# EAGLE design Wobbler_Rev1 (EAGLE 7.7.0)

## Sheet 1 of 5: MCU & Eeprom
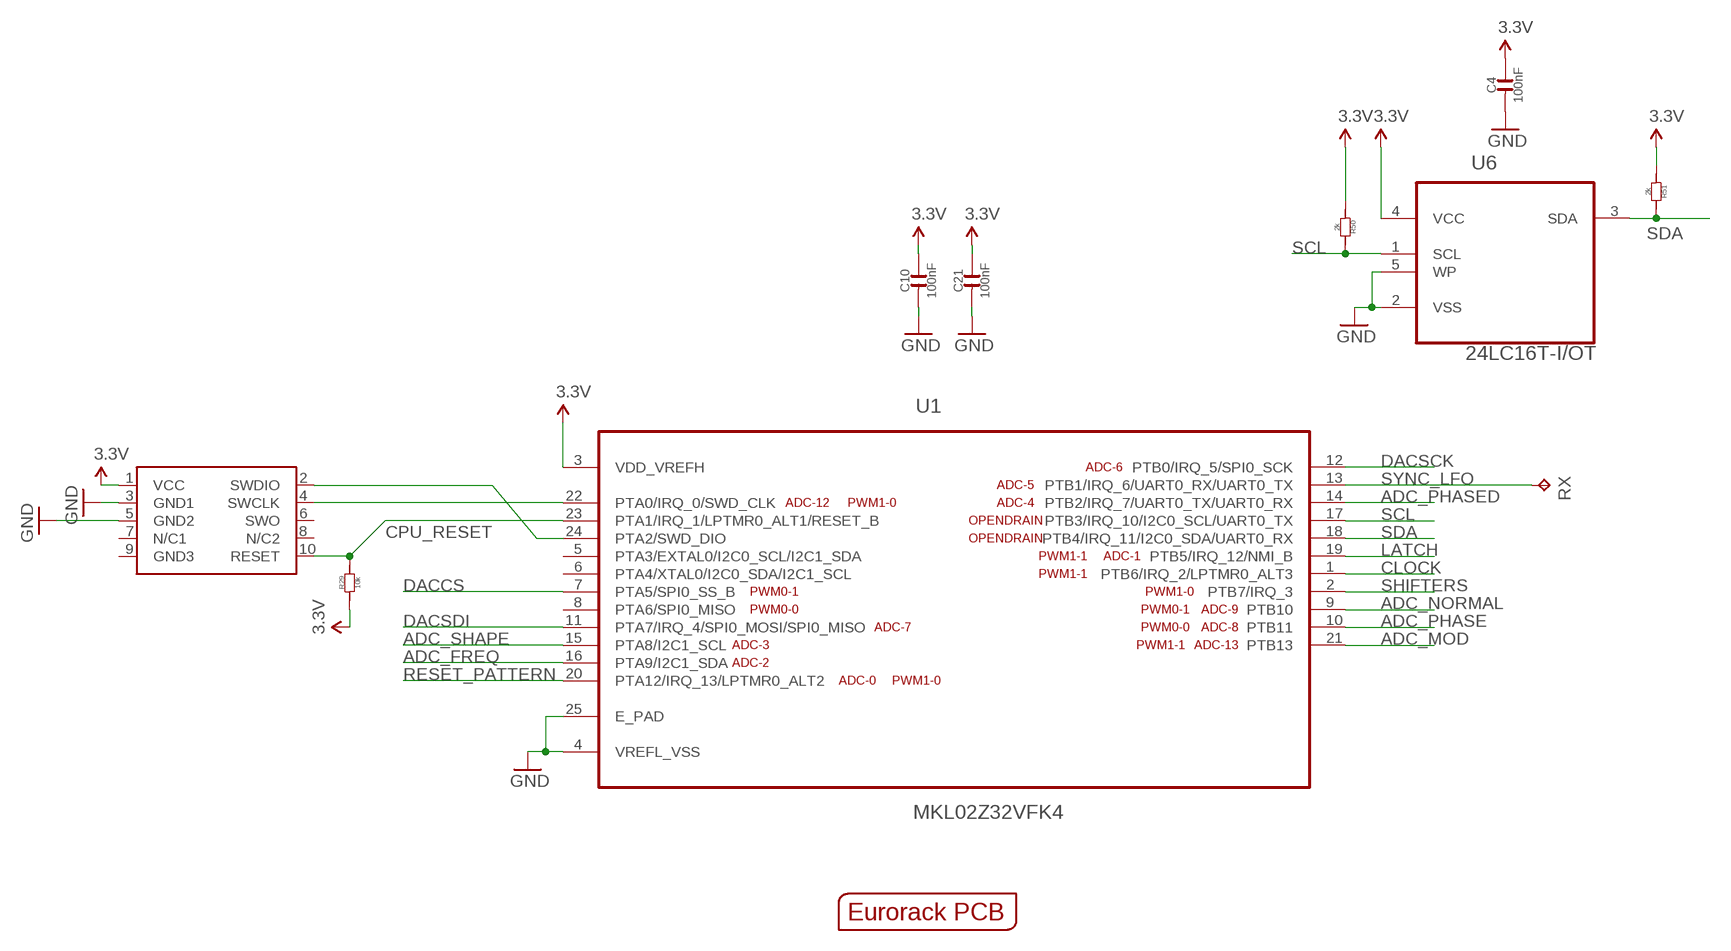
[diagram p0: schematic, sheet 1]

### Parts
C4  100nF  C-0603  [C0603]
C10  100nF  C-0603  [C0603]
C21  100nF  C-0603  [C0603]
OUTLINE  EURORACK_PCB12HP  [EURORACK12HPPCB]
R29  10k  R-0603  [R0603]
R50  2k  R-0603  [R0603]
R51  2k  R-0603  [R0603]
RX  TPB1,27  [B1,27]
SWD1  CORTEX_SWD  [M50-3600542]
U1  MKL02Z32VFK4  [QFN50P400X400X100-25N]
U6  24LC16T-I/OT  24LC00T-I/OT  [SOT95P290X145-5N]

### Nets
3.3V [mediumpower]: C4.2 C10.2 C21.2 R29.1 R50.1 R51.1 SWD1.1(VCC) U1.3(VDD_VREFH) U6.4(VCC) ; also sheet 2,3,4,5
ADC_FREQ: U1.16(PTA9/I2C1_SDA) ; also sheet 5
ADC_MOD: U1.21(PTB13) ; also sheet 5
ADC_NORMAL: U1.9(PTB10) ; also sheet 5
ADC_PHASE: U1.10(PTB11) ; also sheet 5
ADC_PHASED: U1.14(PTB2/IRQ_7/UART0_TX/UART0_RX) ; also sheet 5
ADC_SHAPE: U1.15(PTA8/I2C1_SCL) ; also sheet 5
CLOCK: U1.1(PTB6/IRQ_2/LPTMR0_ALT3) ; also sheet 2
CPU_RESET: R29.2 SWD1.10(RESET) U1.23(PTA1/IRQ_1/LPTMR0_ALT1/RESET_B)
DACCS: U1.7(PTA5/SPI0_SS_B) ; also sheet 3
DACSCK: U1.12(PTB0/IRQ_5/SPI0_SCK) ; also sheet 3
DACSDI: U1.11(PTA7/IRQ_4/SPI0_MOSI/SPI0_MISO) ; also sheet 3
GND [groundplane]: C4.1 C10.1 C21.1 SWD1.3(GND1) SWD1.5(GND2) U1.4(VREFL_VSS) U1.25(E_PAD) U6.2(VSS) U6.5(WP) ; also sheet 2,3,4,5
LATCH: U1.19(PTB5/IRQ_12/NMI_B) ; also sheet 2
RESET_PATTERN: U1.20(PTA12/IRQ_13/LPTMR0_ALT2) ; also sheet 2,5
SCL: R50.2 U1.17(PTB3/IRQ_10/I2C0_SCL/UART0_TX) U6.1(SCL)
SDA: R51.2 U1.18(PTB4/IRQ_11/I2C0_SDA/UART0_RX) U6.3(SDA)
SHIFTERS: U1.2(PTB7/IRQ_3) ; also sheet 2
SWD_CLK: SWD1.4(SWCLK) U1.22(PTA0/IRQ_0/SWD_CLK)
SWD_DIO: SWD1.2(SWDIO) U1.24(PTA2/SWD_DIO)
SYNC_LFO: RX.TP U1.13(PTB1/IRQ_6/UART0_RX/UART0_TX) ; also sheet 5
Unconnected: SWD1.6(SWO) SWD1.7(N/C1) SWD1.8(N/C2) SWD1.9(GND3) U1.5(PTA3/EXTAL0/I2C0_SCL/I2C1_SDA) U1.6(PTA4/XTAL0/I2C0_SDA/I2C1_SCL) U1.8(PTA6/SPI0_MISO)

## Sheet 2 of 5: LEDs & button
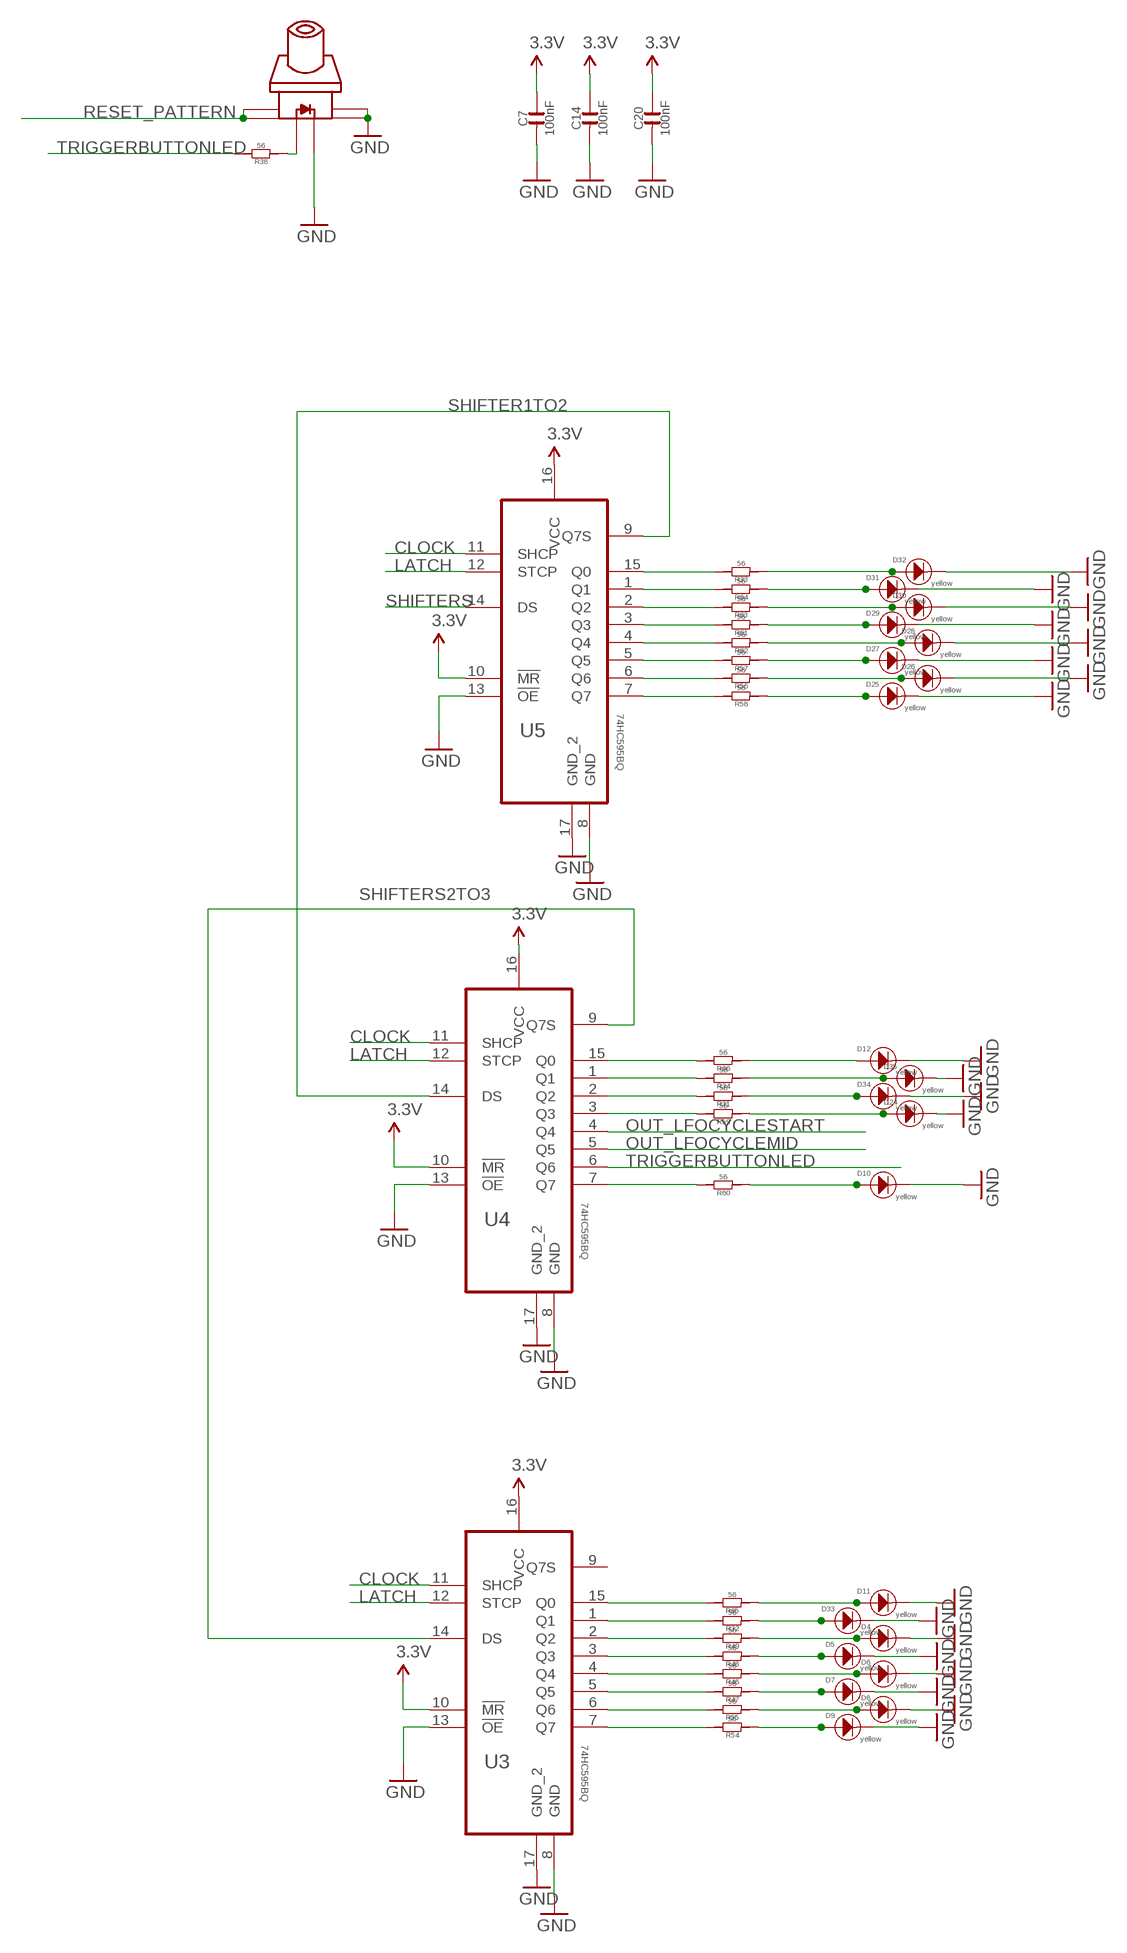
[diagram p1: schematic, sheet 2]

### Parts
C7  100nF  C-0603  [C0603]
C14  100nF  C-0603  [C0603]
C20  100nF  C-0603  [C0603]
D4  yellow  LED3MM  [3MMLED]
D5  yellow  LED3MM  [3MMLED]
D6  yellow  LED3MM  [3MMLED]
D7  yellow  LED3MM  [3MMLED]
D8  yellow  LED3MM  [3MMLED]
D9  yellow  LED3MM  [3MMLED]
D10  yellow  LED3MM  [3MMLED]
D11  yellow  LED3MM  [3MMLED]
D12  yellow  LED3MM  [3MMLED]
D24  yellow  LED3MM  [3MMLED]
D25  yellow  LED3MM  [3MMLED]
D26  yellow  LED3MM  [3MMLED]
D27  yellow  LED3MM  [3MMLED]
D28  yellow  LED3MM  [3MMLED]
D29  yellow  LED3MM  [3MMLED]
D30  yellow  LED3MM  [3MMLED]
D31  yellow  LED3MM  [3MMLED]
D32  yellow  LED3MM  [3MMLED]
D33  yellow  LED3MM  [3MMLED]
D34  yellow  LED3MM  [3MMLED]
D35  yellow  LED3MM  [3MMLED]
R31  56  R-0603  [R0603]
R32  56  R-0603  [R0603]
R33  56  R-0603  [R0603]
R34  56  R-0603  [R0603]
R38  56  R-0603  [R0603]
R46  56  R-0603  [R0603]
R47  56  R-0603  [R0603]
R48  56  R-0603  [R0603]
R49  56  R-0603  [R0603]
R54  56  R-0603  [R0603]
R55  56  R-0603  [R0603]
R56  56  R-0603  [R0603]
R57  56  R-0603  [R0603]
R58  56  R-0603  [R0603]
R59  56  R-0603  [R0603]
R60  56  R-0603  [R0603]
R61  56  R-0603  [R0603]
R62  56  R-0603  [R0603]
R63  56  R-0603  [R0603]
R64  56  R-0603  [R0603]
R65  56  R-0603  [R0603]
R66  56  R-0603  [R0603]
U3  74HC595BQ  [QFN50P250X350X100-17N]
U4  74HC595BQ  [QFN50P250X350X100-17N]
U5  74HC595BQ  [QFN50P250X350X100-17N]
U$1  SWITCH_W_LED_PB6149L-X-102YELLOW  [PB6149L]

### Nets
3.3V [mediumpower]: C7.2 C14.2 C20.2 U3.10(!MR) U3.16(VCC) U4.10(!MR) U4.16(VCC) U5.10(!MR) U5.16(VCC) ; also sheet 1,3,4,5
CLOCK: U3.11(SHCP) U4.11(SHCP) U5.11(SHCP) ; also sheet 1
GND [groundplane]: C7.1 C14.1 C20.1 D4.- D5.- D6.- D7.- D8.- D9.- D10.- D11.- D12.- D24.- D25.- D26.- D27.- D28.- D29.- D30.- D31.- D32.- D33.- D34.- D35.- U3.8(GND) U3.13(!OE) U3.17(GND_2) U4.8(GND) U4.13(!OE) U4.17(GND_2) U5.8(GND) U5.13(!OE) U5.17(GND_2) U$1.3 U$1.4 U$1.LEDNEG(NEG) ; also sheet 1,3,4,5
LATCH: U3.12(STCP) U4.12(STCP) U5.12(STCP) ; also sheet 1
N$1: R33.2 U5.15(Q0)
N$14: D7.+ R47.1
N$19: R64.2 U5.1(Q1)
N$22: R63.2 U5.2(Q2)
N$26: R61.2 U5.3(Q3)
N$28: D28.+ R62.1
N$30: R62.2 U5.4(Q4)
N$31: R57.2 U5.5(Q5)
N$32: D29.+ R61.1
N$35: R56.2 U5.6(Q6)
N$36: R58.2 U5.7(Q7)
N$37: R59.2 U4.3(Q3)
N$38: R54.2 U3.7(Q7)
N$39: R55.2 U3.6(Q6)
N$40: R47.2 U3.5(Q5)
N$41: R38.1 U$1.LEDPOS(POS)
N$43: R46.2 U3.4(Q4)
N$46: D6.+ R46.1
N$47: D5.+ R48.1
N$48: D4.+ R49.1
N$49: D8.+ R55.1
N$50: D9.+ R54.1
N$51: D10.+ R60.1
N$52: D11.+ R65.1
N$53: R48.2 U3.3(Q3)
N$54: R49.2 U3.2(Q2)
N$55: R32.2 U3.1(Q1)
N$56: R65.2 U3.15(Q0)
N$57: R60.2 U4.7(Q7)
N$58: R34.2 U4.1(Q1)
N$59: R31.2 U4.2(Q2)
N$62: R66.2 U4.15(Q0)
N$65: D12.+ R66.1
N$73: D27.+ R57.1
N$74: D26.+ R56.1
N$75: D25.+ R58.1
N$76: D24.+ R59.1
N$77: D30.+ R63.1
N$78: D31.+ R64.1
N$79: D32.+ R33.1
N$80: D33.+ R32.1
N$81: D34.+ R31.1
N$82: D35.+ R34.1
OUT_LFOCYCLEMID: U4.5(Q5) ; also sheet 3
OUT_LFOCYCLESTART: U4.4(Q4) ; also sheet 3
RESET_PATTERN: U$1.1 U$1.2 ; also sheet 1,5
SHIFTER1TO2: U4.14(DS) U5.9(Q7S)
SHIFTERS: U5.14(DS) ; also sheet 1
SHIFTERS2TO3: U3.14(DS) U4.9(Q7S)
TRIGGERBUTTONLED: R38.2 U4.6(Q6)
Unconnected: U3.9(Q7S)

## Sheet 3 of 5: DAC & Trigger outs
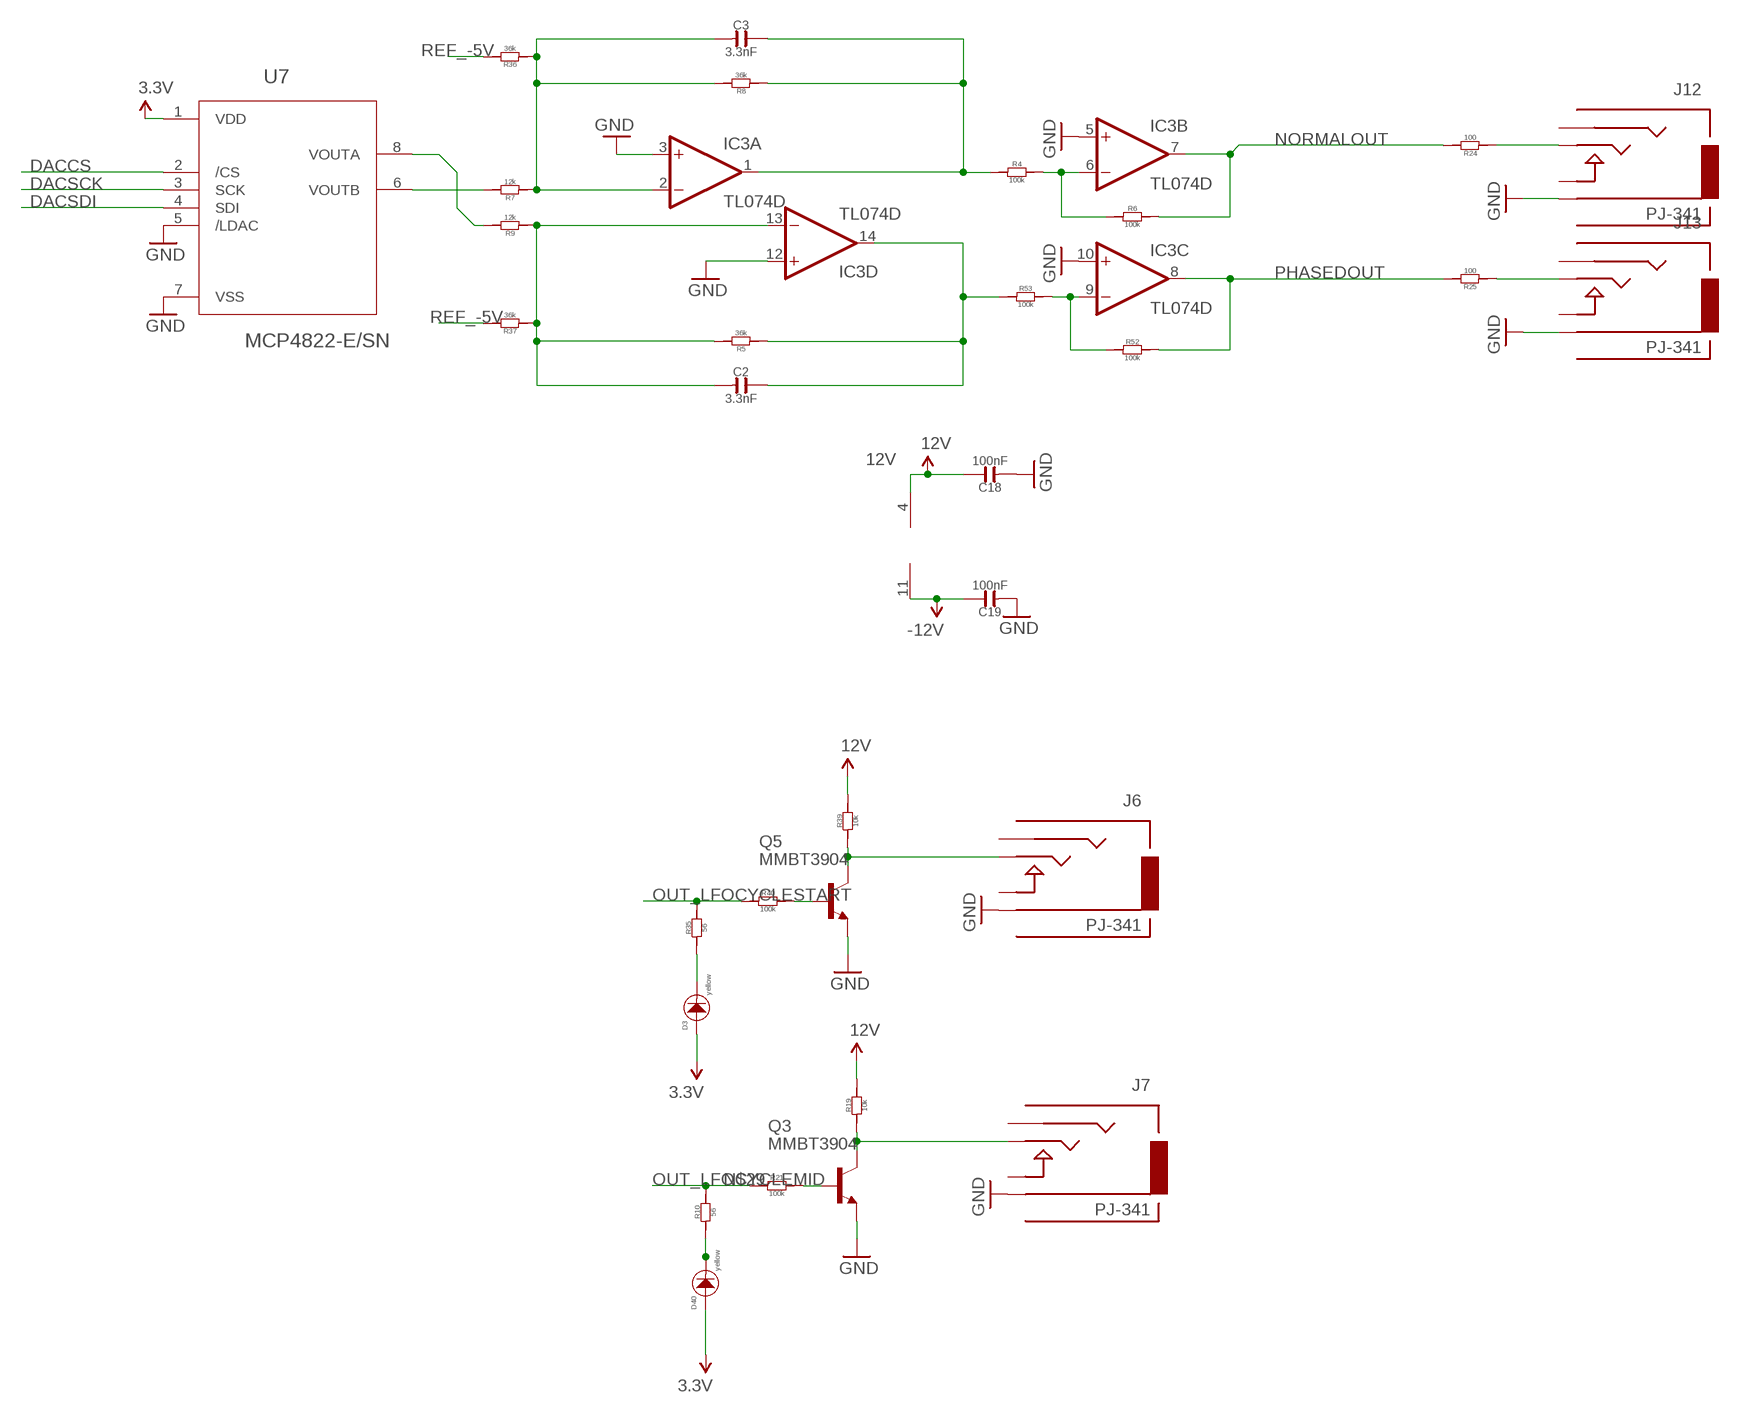
[diagram p2: schematic, sheet 3]

### Parts
C2  3.3nF  C-0603  [C0603]
C3  3.3nF  C-0603  [C0603]
C18  100nF  C-0603  [C0603]
C19  100nF  C-0603  [C0603]
D3  yellow  LED3MM  [3MMLED]
D40  yellow  LED3MM  [3MMLED]
IC3  TL074D  [SO14]
J6  PJ-341  AUDIO-JACKOUTPUT  [3.5MM-JACK-SWITCH-13MM-OUTPUT]
J7  PJ-341  AUDIO-JACKOUTPUT  [3.5MM-JACK-SWITCH-13MM-OUTPUT]
J12  PJ-341  AUDIO-JACKOUTPUT  [3.5MM-JACK-SWITCH-13MM-OUTPUT]
J13  PJ-341  AUDIO-JACKOUTPUT  [3.5MM-JACK-SWITCH-13MM-OUTPUT]
Q3  MMBT3904  MMBT3904LT1-NPN-SOT23-BEC  [SOT23-BEC]
Q5  MMBT3904  MMBT3904LT1-NPN-SOT23-BEC  [SOT23-BEC]
R4  100k  R-0603  [R0603]
R5  36k  R-0603  [R0603]
R6  100k  R-0603  [R0603]
R7  12k  R-0603  [R0603]
R8  36k  R-0603  [R0603]
R9  12k  R-0603  [R0603]
R10  56  R-0603  [R0603]
R19  10k  R-0603  [R0603]
R21  100k  R-0603  [R0603]
R24  100  R-0603  [R0603]
R25  100  R-0603  [R0603]
R35  56  R-0603  [R0603]
R36  36k  R-0603  [R0603]
R37  36k  R-0603  [R0603]
R39  10k  R-0603  [R0603]
R40  100k  R-0603  [R0603]
R52  100k  R-0603  [R0603]
R53  100k  R-0603  [R0603]
U7  MCP4822-E/SN  [SOIC8-N_MC]

### Nets
3.3V [mediumpower]: D3.+ D40.+ U7.1(VDD) ; also sheet 1,2,4,5
12V [heavypower]: C18.2 IC3.4(P:V+) R19.2 R39.2 ; also sheet 4
-12V [heavypower]: C19.2 IC3.11(P:V-) ; also sheet 4
DACCS: U7.2(/CS) ; also sheet 1
DACSCK: U7.3(SCK) ; also sheet 1
DACSDI: U7.4(SDI) ; also sheet 1
GND [groundplane]: C18.1 C19.1 IC3.3(A:+IN) IC3.5(B:+IN) IC3.10(C:+IN) IC3.12(D:+IN) J6.RING@3(RING) J7.RING@3(RING) J12.RING@3(RING) J13.RING@3(RING) Q3.E Q5.E U7.5(/LDAC) U7.7(VSS) ; also sheet 1,2,4,5
N$2: IC3.6(B:-IN) R4.2 R6.1
N$5: R9.2 U7.8(VOUTA)
N$7: R7.2 U7.6(VOUTB)
N$9: C2.1 IC3.13(D:-IN) R5.2 R9.1 R37.1
N$10: C3.1 IC3.2(A:-IN) R7.1 R8.2 R36.1
N$17: IC3.9(C:-IN) R52.1 R53.2
N$18: C3.2 IC3.1(A:OUT) R4.1 R8.1
N$20: J13.TIP@3(TIP) R25.1
N$21: J12.TIP@3(TIP) R24.1
N$23: D40.- R10.1
N$24: C2.2 IC3.14(D:OUT) R5.1 R53.1
N$25: Q3.B R21.2
N$27: D3.- R35.1
N$29: J7.TIP@3(TIP) Q3.C R19.1
N$60: Q5.B R40.2
N$61: J6.TIP@3(TIP) Q5.C R39.1
NORMALOUT: IC3.7(B:OUT) R6.2 R24.2
OUT_LFOCYCLEMID: R10.2 R21.1 ; also sheet 2
OUT_LFOCYCLESTART: R35.2 R40.1 ; also sheet 2
PHASEDOUT: IC3.8(C:OUT) R25.2 R52.2
REF_-5V: R36.2 R37.2 ; also sheet 4,5
Unconnected: J6.SECOND@3(SECOND) J6.SWITCH@3(SWITCH) J7.SECOND@3(SECOND) J7.SWITCH@3(SWITCH) J12.SECOND@3(SECOND) J12.SWITCH@3(SWITCH) J13.SECOND@3(SECOND) J13.SWITCH@3(SWITCH)

## Sheet 4 of 5: Power
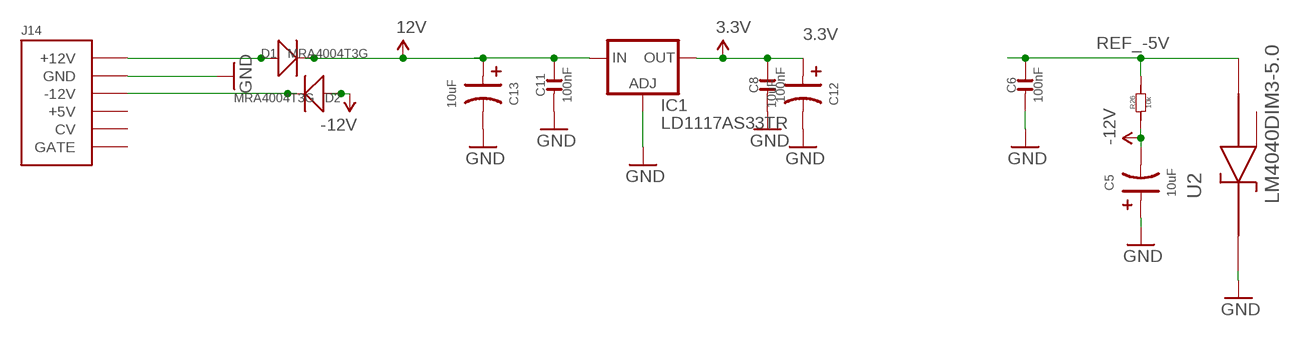
[diagram p3: schematic, sheet 4]

### Parts
C5  10uF  C-POLAR-A  [AVX-A]
C6  100nF  C-0603  [C0603]
C8  100nF  C-0603  [C0603]
C11  100nF  C-0603  [C0603]
C12  10uF  C-POLAR-A  [AVX-A]
C13  10uF  C-POLAR-A  [AVX-A]
D1  MRA4004T3G  D-SMA  [DO-214AC]
D2  MRA4004T3G  D-SMA  [DO-214AC]
IC1  LD1117AS33TR  [SOT223]
J14  POWERSMT  [2X08_SMT_HEADER]
R26  10k  R-0603  [R0603]
U2  LM4040DIM3-5.0  [SOT95P237X112-3N]

### Nets
3.3V [mediumpower]: C8.2 C12.+ IC1.2(OUT) IC1.4(OUT) ; also sheet 1,2,3,5
12V [heavypower]: C11.2 C13.+ D1.2(-) IC1.3(IN) ; also sheet 3
-12V [heavypower]: C5.- D2.1(+) R26.1 ; also sheet 3
GND [groundplane]: C5.+ C6.1 C8.1 C11.1 C12.- C13.- IC1.1(ADJ) J14.3(GND) J14.4(GND) J14.5(GND) J14.6(GND) J14.7(GND) J14.8(GND) U2.1(CATHODE) ; also sheet 1,2,3,5
N$13 [heavypower]: D1.1(+) J14.9(+12V) J14.10(+12V)
N$64 [heavypower]: D2.2(-) J14.1(-12V) J14.2(-12V)
REF_-5V: C6.2 R26.2 U2.2(ANODE) ; also sheet 3,5
Unconnected: J14.11(+5V) J14.12(+5V) J14.13(CV) J14.14(CV) J14.15(GATE) J14.16(GATE) U2.3(NC)

## Sheet 5 of 5: Inputs & Knobs
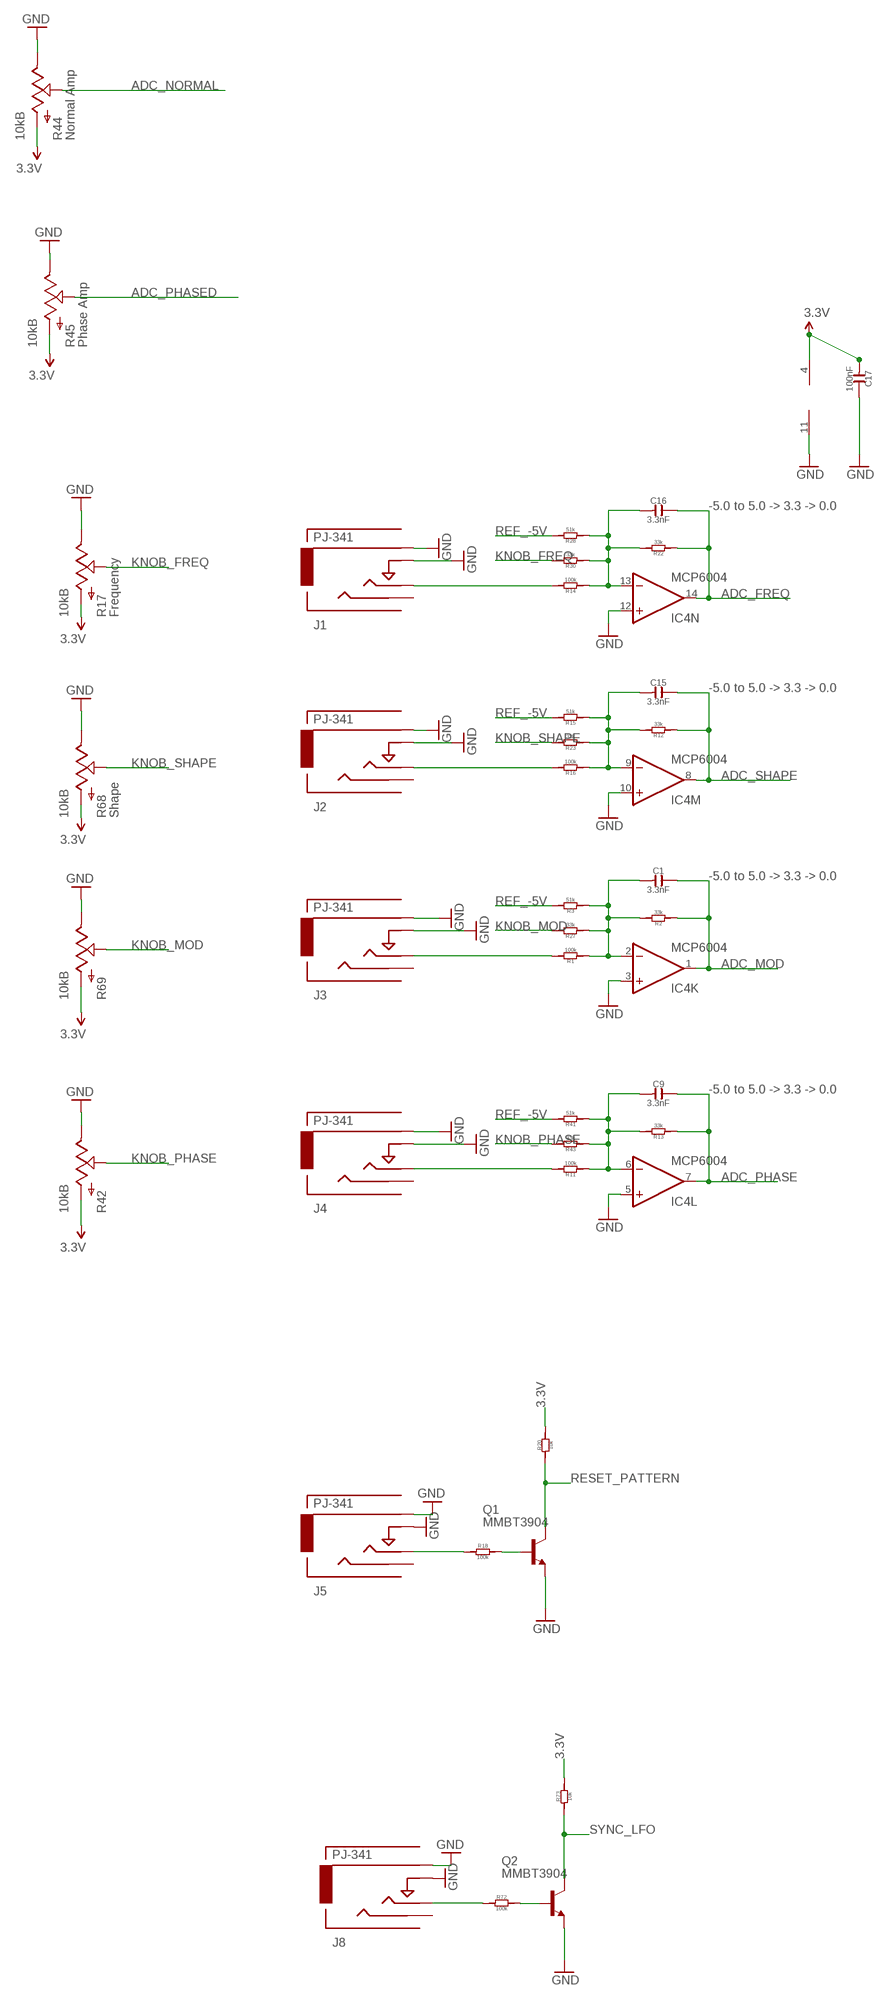
[diagram p4: schematic, sheet 5]

### Parts
C1  3.3nF  C-0603  [C0603]
C9  3.3nF  C-0603  [C0603]
C15  3.3nF  C-0603  [C0603]
C16  3.3nF  C-0603  [C0603]
C17  100nF  C-0603  [C0603]
IC4  MCP6004  [SO14]
J1  PJ-341  AUDIO-JACKINPUT  [3.5MM-JACK-SWITCH-13MM-INPUT]
J2  PJ-341  AUDIO-JACKINPUT  [3.5MM-JACK-SWITCH-13MM-INPUT]
J3  PJ-341  AUDIO-JACKINPUT  [3.5MM-JACK-SWITCH-13MM-INPUT]
J4  PJ-341  AUDIO-JACKINPUT  [3.5MM-JACK-SWITCH-13MM-INPUT]
J5  PJ-341  AUDIO-JACKINPUT  [3.5MM-JACK-SWITCH-13MM-INPUT]
J8  PJ-341  AUDIO-JACKINPUT  [3.5MM-JACK-SWITCH-13MM-INPUT]
Q1  MMBT3904  MMBT3904LT1-NPN-SOT23-BEC  [SOT23-BEC]
Q2  MMBT3904  MMBT3904LT1-NPN-SOT23-BEC  [SOT23-BEC]
R1  100k  R-0603  [R0603]
R2  33k  R-0603  [R0603]
R3  51k  R-0603  [R0603]
R11  100k  R-0603  [R0603]
R12  33k  R-0603  [R0603]
R13  33k  R-0603  [R0603]
R14  100k  R-0603  [R0603]
R15  51k  R-0603  [R0603]
R16  100k  R-0603  [R0603]
R17  10kB  POTZEPHPOT  [OG-POTS_ALPS_POT_VERTICAL]
R18  100k  R-0603  [R0603]
R20  10k  R-0603  [R0603]
R22  33k  R-0603  [R0603]
R23  33k  R-0603  [R0603]
R27  33k  R-0603  [R0603]
R28  51k  R-0603  [R0603]
R30  33k  R-0603  [R0603]
R41  51k  R-0603  [R0603]
R42  10kB  POTZEPHPOT  [OG-POTS_ALPS_POT_VERTICAL]
R43  33k  R-0603  [R0603]
R44  10kB  POTZEPHPOT  [OG-POTS_ALPS_POT_VERTICAL]
R45  10kB  POTZEPHPOT  [OG-POTS_ALPS_POT_VERTICAL]
R68  10kB  POTZEPHPOT  [OG-POTS_ALPS_POT_VERTICAL]
R69  10kB  POTZEPHPOT  [OG-POTS_ALPS_POT_VERTICAL]
R72  100k  R-0603  [R0603]
R73  10k  R-0603  [R0603]

### Nets
3.3V [mediumpower]: C17.1 IC4.4(O:V+) R17.P$3(A) R20.2 R42.P$3(A) R44.P$3(A) R45.P$3(A) R68.P$3(A) R69.P$3(A) R73.2 ; also sheet 1,2,3,4
ADC_FREQ: C16.2 IC4.14(N:OUT) R22.1 ; also sheet 1
ADC_MOD: C1.2 IC4.1(K:OUT) R2.1 ; also sheet 1
ADC_NORMAL: R44.P$2(S) ; also sheet 1
ADC_PHASE: C9.2 IC4.7(L:OUT) R13.1 ; also sheet 1
ADC_PHASED: R45.P$2(S) ; also sheet 1
ADC_SHAPE: C15.2 IC4.8(M:OUT) R12.1 ; also sheet 1
GND [groundplane]: C17.2 IC4.3(K:+IN) IC4.5(L:+IN) IC4.10(M:+IN) IC4.11(O:V-) IC4.12(N:+IN) J1.RING@3(RING) J1.SWITCH@3(SWITCH) J2.RING@3(RING) J2.SWITCH@3(SWITCH) J3.RING@3(RING) J3.SWITCH@3(SWITCH) J4.RING@3(RING) J4.SWITCH@3(SWITCH) J5.RING@3(RING) J5.SWITCH@3(SWITCH) J8.RING@3(RING) J8.SWITCH@3(SWITCH) Q1.E Q2.E R17.P$1(E) R42.P$1(E) R44.P$1(E) R45.P$1(E) R68.P$1(E) R69.P$1(E) ; also sheet 1,2,3,4
KNOB_FREQ: R17.P$2(S) R30.2
KNOB_MOD: R27.2 R69.P$2(S)
KNOB_PHASE: R42.P$2(S) R43.2
KNOB_SHAPE: R23.2 R68.P$2(S)
N$3: J2.TIP@3(TIP) R16.2
N$4: C15.1 IC4.9(M:-IN) R12.2 R15.1 R16.1 R23.1
N$6: J3.TIP@3(TIP) R1.2
N$8: C1.1 IC4.2(K:-IN) R1.1 R2.2 R3.1 R27.1
N$11: J4.TIP@3(TIP) R11.2
N$12: C9.1 IC4.6(L:-IN) R11.1 R13.2 R41.1 R43.1
N$15: Q1.B R18.2
N$16: J5.TIP@3(TIP) R18.1
N$33: J1.TIP@3(TIP) R14.2
N$34: C16.1 IC4.13(N:-IN) R14.1 R22.2 R28.1 R30.1
N$44: Q2.B R72.2
N$45: J8.TIP@3(TIP) R72.1
REF_-5V: R3.2 R15.2 R28.2 R41.2 ; also sheet 3,4
RESET_PATTERN: Q1.C R20.1 ; also sheet 1,2
SYNC_LFO: Q2.C R73.1 ; also sheet 1
Unconnected: J1.SECOND@3(SECOND) J2.SECOND@3(SECOND) J3.SECOND@3(SECOND) J4.SECOND@3(SECOND) J5.SECOND@3(SECOND) J8.SECOND@3(SECOND)

### Notes on the sheet
- -5.0 to 5.0 -> 3.3 -> 0.0
- -5.0 to 5.0 -> 3.3 -> 0.0
- -5.0 to 5.0 -> 3.3 -> 0.0
- -5.0 to 5.0 -> 3.3 -> 0.0

## Library data of the parts
C1-C3 C9 C15 C16 = OPL:C*; OC_FARNELL: unknown
C4 C7 C8 C10 C11 C14 C17-C21 = OPL:C*; MF: MULTICOMP; MPN: MC0603F104Z160CT; OC_FARNELL: 1759017
C5 C12 C13 = EurorackModularParts:C-POLAR*; MF: AVX; MPN: TAJB106K020RNJ; OC_FARNELL: 197427
C6 = OPL:C*; MF: AVX; MPN: 06035C104KAT2A; OC_FARNELL: 1301804
D1 D2 = OPL:D*: DIODE; MF: VISHAY; MPN: US1G-E3/5AT; OC_FARNELL: 9551824
D3-D12 D24-D35 D40 = EurorackModularParts:LED*: LED
IC1 = ld-components:LD1117A?*: Low drop fixed and adjustable positive voltage regulators 1 A Source: http://www.st.com/stonline/products/literature/ds/7194/ld1117axx.pdf; MF: STMICROELECTRONICS; MPN: LD1117AS33TR; OC_FARNELL: 1467776
IC3 = EurorackModularParts:TL074: OP AMP; MF: TEXAS INSTRUMENTS; MPN: TL074CD; OC_FARNELL: 1103010
IC4 = EurorackModularParts:MCP6004; MF: MICROCHIP; MPN: MCP6004-I/SL.; OC_FARNELL: 1605572
J1 = EurorackModularParts:AUDIO-JACK: Switching Mono 3.5mm Audio Jack from Erthenvar.; DESC: Frequency; OC_FARNELL: unknown
J2 = EurorackModularParts:AUDIO-JACK: Switching Mono 3.5mm Audio Jack from Erthenvar.; DESC: Shape; OC_FARNELL: unknown
J3 = EurorackModularParts:AUDIO-JACK: Switching Mono 3.5mm Audio Jack from Erthenvar.; DESC: Mod; OC_FARNELL: unknown
J4 = EurorackModularParts:AUDIO-JACK: Switching Mono 3.5mm Audio Jack from Erthenvar.; DESC: Phase; OC_FARNELL: unknown
J5 = EurorackModularParts:AUDIO-JACK: Switching Mono 3.5mm Audio Jack from Erthenvar.; DESC: Reset; OC_FARNELL: unknown
J6 = EurorackModularParts:AUDIO-JACK: Switching Mono 3.5mm Audio Jack from Erthenvar.; DESC: Loop; OC_FARNELL: unknown
J7 = EurorackModularParts:AUDIO-JACK: Switching Mono 3.5mm Audio Jack from Erthenvar.; DESC: Mid; OC_FARNELL: unknown
J8 = EurorackModularParts:AUDIO-JACK: Switching Mono 3.5mm Audio Jack from Erthenvar.; DESC: Sync; OC_FARNELL: unknown
J12 = EurorackModularParts:AUDIO-JACK: Switching Mono 3.5mm Audio Jack from Erthenvar.; DESC: Normal Out; OC_FARNELL: unknown
J13 = EurorackModularParts:AUDIO-JACK: Switching Mono 3.5mm Audio Jack from Erthenvar.; DESC: Phased Out; OC_FARNELL: unknown
J14 = EurorackModularParts:POWER; OC_FARNELL: unknown
OUTLINE = EurorackModularParts:EURORACK_PCB; OC_FARNELL: unknown
Q1-Q3 Q5 = transistor:*-NPN-: NPN Transistror BF959 corrected 2008.03.06; MF: NXP; MPN: PMBT3904,215; OC_FARNELL: 2336795
R1-R16 R18-R41 R43 R46-R66 R72 R73 = OPL:R*; OC_FARNELL: unknown
R17 = EurorackModularParts:POT; DESC: Frequency; OC_FARNELL: unknown
R42 = EurorackModularParts:POT; DESC: Phase; OC_FARNELL: unknown
R44 = EurorackModularParts:POT; DESC: Normal Amp; OC_FARNELL: unknown
R45 = EurorackModularParts:POT; DESC: Phase Amp; OC_FARNELL: unknown
R68 = EurorackModularParts:POT; DESC: Shape; OC_FARNELL: unknown
R69 = EurorackModularParts:POT; DESC: Mod; OC_FARNELL: unknown
RX = testpad:TP: Test pad; OC_FARNELL: unknown
SWD1 = carrilib with jtags:CORTEX_SWD: .05" Cortex M Connector in SWD mode Manufacturer: Generic Part Number: Cortex M SWD Notes: I use Harwin M50-3600542 connectors; OC_FARNELL: unknown
U1 = FarnellThings:MKL02Z32VFK4: IC, MCU, 32BIT, CORTEX M0+, 48MHZ, QFN-24; MF: NXP; MPN: MKL02Z32VFK4; OC_FARNELL: 2321481; OC_NEWARK: 61W9887; PACKAGE: QFN-24; SUPPLIER: FREESCALE SEMICONDUCTOR
U2 = FarnellThings:LM4040DIM3-5.0: IC, Precision Micropower Shunt Voltage Reference, 5V,SOT-23-3; MF: TEXAS INSTRUMENTS; MPN: LM4040DIM3-5.0; OC_FARNELL: 9778330; OC_NEWARK: 97K3489; PACKAGE: SOT-23-3; SUPPLIER: TEXAS INSTRUMENTS
U3-U5 = FarnellThings:74HC595BQ: 8-bit serial-in, serial or parallel-out shift register,QFN-16; MF: NXP; MPN: 74HC595BQ; OC_FARNELL: 2164850; OC_NEWARK: 43W8000; PACKAGE: QFN-16; SUPPLIER: NXP
U6 = EurorackModularParts:24LC00T-I/OT: IC, EEPROM 128BIT SERIAL 400KHZ SOT-23-5; MF: MICROCHIP; MPN: 24LC00T-I/OT; OC_FARNELL: 9757864; OC_NEWARK: 62K0574; PACKAGE: SOT-23-5; SUPPLIER: MICROCHIP
U7 = FarnellThings:MCP4822-E/SN: 12 Bit DAC; DESCRIPTION: 12 Bit DAC; MF: MICROCHIP; MPN: MCP4822-E/SN; OC_FARNELL: 1439414; OC_NEWARK: 31K2975; PACKAGE: SOIC-8; SUPPLIER: Microchip
U$1 = zephod-components:SWITCH_W_LED_PB6149L-X-102

## Net classes
0 default: width 0.203 mm, clearance 0.178 mm
1 heavypower: width 0.254 mm
2 mediumpower: width 0.254 mm
3 groundplane: width 0.203 mm, clearance 0.203 mm

## Board
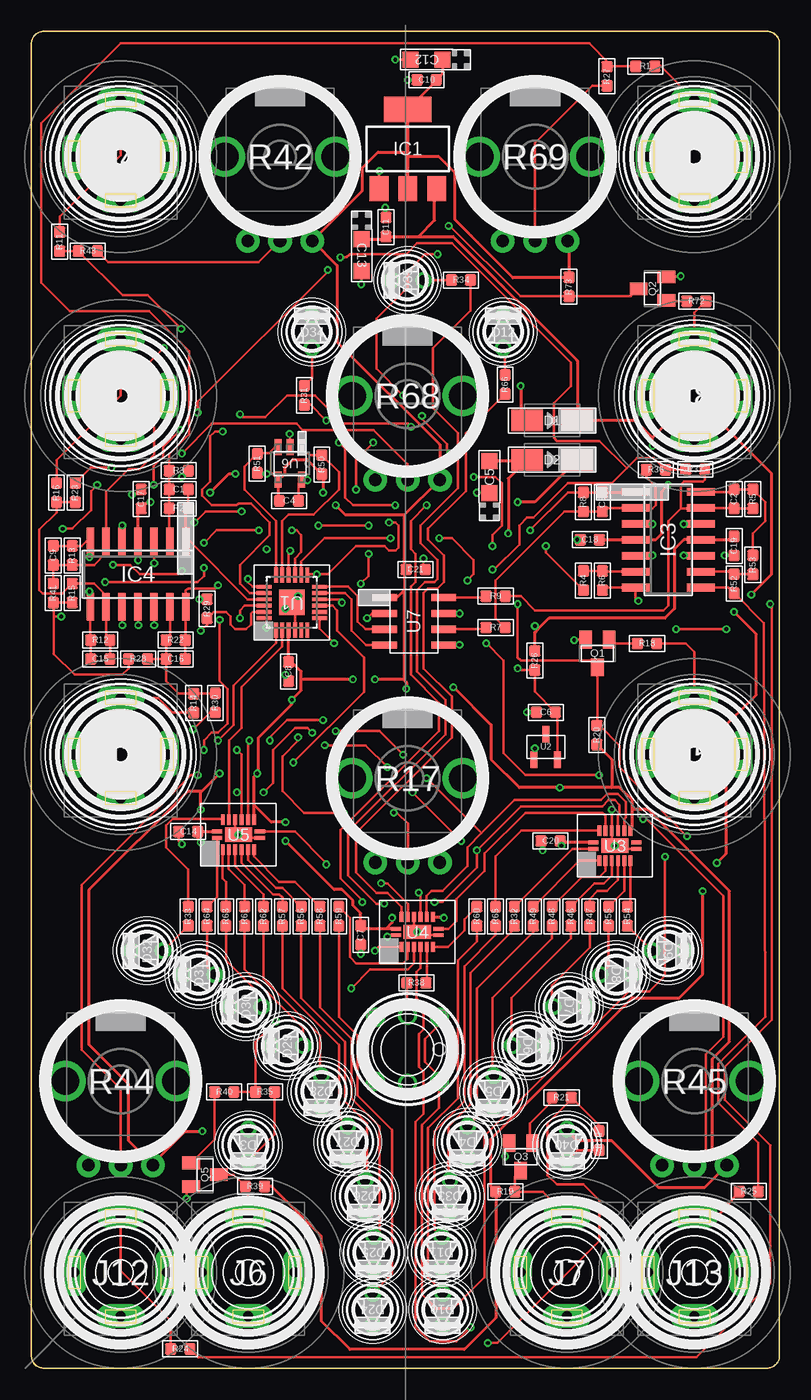
[diagram p5: board, top side]
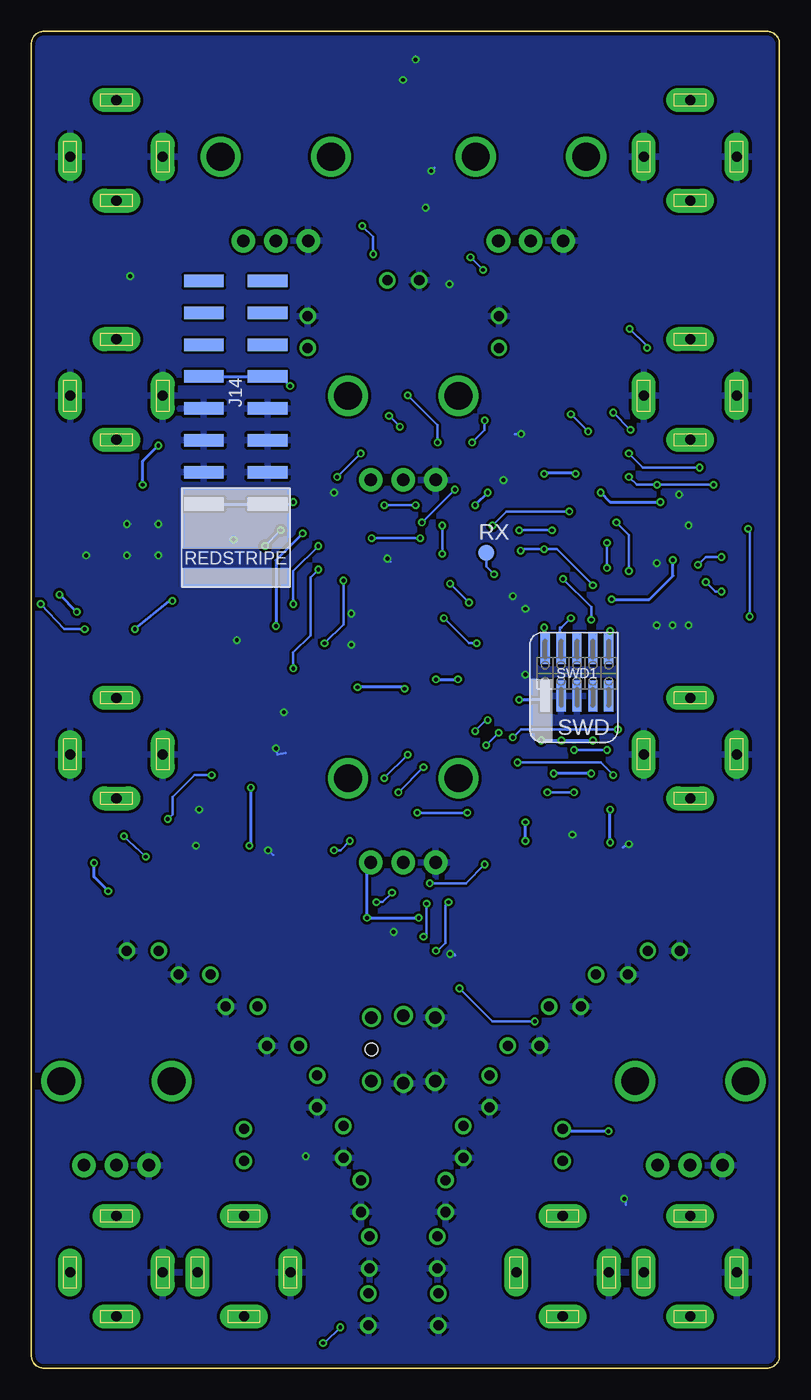
[diagram p6: board, bottom side, seen from below]

Size 59.62 x 106.5 mm. Coordinates in mm from the lower left corner, seen from the top.
Copper layers (1*16): Top 0.035mm / dielectric 1.5mm / Bottom 0.035mm
Design rules "dirt_cheap_dirty_boards.v1": minimum track width 5mil, minimum drill 12mil, track to track 5mil, track to pad 5mil, pad to pad 5mil, via to via 5mil, smd to smd 0mil, copper to edge 10mil, drill to drill 10mil, minimum pad ring 10mil, minimum via ring 6mil, stop-mask expansion 2mil, vias tented up to drill 25mil, thermal gap 10mil

### Footprints (pad centres in the part's own frame; a part is rotated, then mirrored left to right if it is on the bottom)
C0603 = smd 0.889 x 0.889: 1 -0.762,0; 2 0.762,0
AVX-A = smd 1.27 x 1.27: + -1.27,0; - 1.27,0
DO-214AC = smd 2.5 x 1.7: 1 -2,0; 2 2,0
3MMLED = drill 0.8: + -1.27,0; - 1.27,0
SOT223 = smd 1.5 x 2: 1 -2.3,-3.15; 2 0,-3.15; 3 2.3,-3.15 | smd 3.8 x 2: 4 0,3.15
SO14 = smd 0.6 x 2.2: 1 -3.81,-2.6; 2 -2.54,-2.6; 3 -1.27,-2.6; 4 0,-2.6; 5 1.27,-2.6; 6 2.54,-2.6; 7 3.81,-2.6; 8 3.81,2.6; 9 2.54,2.6; 10 1.27,2.6; 11 0,2.6; 12 -1.27,2.6; 13 -2.54,2.6; 14 -3.81,2.6
3.5MM-JACK-SWITCH-13MM-INPUT = drill 0.8 pad 1.93 long: RING@3 -3.7,0; SECOND@3 0,-3.5; SWITCH@3 3.7,0; TIP@3 0,4.5
3.5MM-JACK-SWITCH-13MM-OUTPUT = drill 0.8 pad 1.93 long: RING@3 -3.7,0; SECOND@3 0,-3.5; SWITCH@3 3.7,0; TIP@3 0,4.5
2X08_SMT_HEADER = smd 1 x 3.17: 1 -8.89,-2.54; 2 -8.89,2.54; 3 -6.35,-2.54; 4 -6.35,2.54; 5 -3.81,-2.54; 6 -3.81,2.54; 7 -1.27,-2.54; 8 -1.27,2.54; 9 1.27,-2.54; 10 1.27,2.54; 11 3.81,-2.54; 12 3.81,2.54; 13 6.35,-2.54; 14 6.35,2.54; 15 8.89,-2.54; 16 8.89,2.54
SOT23-BEC = smd 1 x 1.4: B -0.95,-1.1; C 0,1.1; E 0.95,-1.1
R0603 = smd 0.889 x 0.889: 1 -0.762,0; 2 0.762,0
OG-POTS_ALPS_POT_VERTICAL = drill 1 pad 1.88: P$1 -2.58,-6.7; P$2 0,-6.7; P$3 2.58,-6.7 | drill 2.2 pad 3.175: P$4 4.4,0; P$5 -4.4,0
B1,27 = smd 1.27 x 1.27: TP 0,0
M50-3600542 = smd 0.75 x 2.5: 1 -2.54,-1.81; 2 -2.54,2; 3 -1.27,-1.81; 4 -1.27,2; 5 0,-1.81; 6 0,2; 7 1.27,-1.81; 8 1.27,2; 9 2.54,-1.81; 10 2.54,2
QFN50P400X400X100-25N = smd 1.2 x 0.3: 1 -2.2,1.245; 2 -2.2,0.762; 3 -2.2,0.254; 4 -2.2,-0.254; 5 -2.2,-0.762; 6 -2.2,-1.245; 13 2.2,-1.245; 14 2.2,-0.762; 15 2.2,-0.254; 16 2.2,0.254; 17 2.2,0.762; 18 2.2,1.245 | smd 0.3 x 1.2: 7 -1.245,-2.2; 8 -0.762,-2.2; 9 -0.254,-2.2; 10 0.254,-2.2; 11 0.762,-2.2; 12 1.245,-2.2; 19 1.245,2.2; 20 0.762,2.2; 21 0.254,2.2; 22 -0.254,2.2 | smd 0.305 x 1.2: 23 -0.762,2.2; 24 -1.245,2.2 | smd 2.032 x 2.032: 25 0,0
SOT95P237X112-3N = smd 1.321 x 0.559: 1 -1.016,0.94; 2 -1.016,-0.94; 3 1.016,0
QFN50P250X350X100-17N = smd 0.305 x 0.813: 1 -0.254,1.702; 8 -0.254,-1.702; 9 0.254,-1.702; 16 0.254,1.702 | smd 0.813 x 0.305: 2 -1.194,1.245; 3 -1.194,0.762; 4 -1.194,0.254; 5 -1.194,-0.254; 6 -1.194,-0.762; 7 -1.194,-1.245; 10 1.194,-1.245; 11 1.194,-0.762; 12 1.194,-0.254; 13 1.194,0.254; 14 1.194,0.762; 15 1.194,1.245 | smd 1.143 x 2.159: 17 0,0
SOT95P290X145-5N = smd 1.27 x 0.559: 1 -1.295,0.94; 2 -1.295,0; 3 -1.295,-0.94; 4 1.295,-0.94; 5 1.295,0.94
SOIC8-N_MC = smd 1.981 x 0.559: 1 -2.362,1.905; 2 -2.362,0.635; 3 -2.362,-0.635; 4 -2.362,-1.905; 5 2.362,-1.905; 6 2.362,-0.635; 7 2.362,0.635; 8 2.362,1.905
PB6149L = drill 1: 1 2.54,2.54; 2 2.54,-2.54; 3 -2.54,2.54; 4 -2.54,-2.54; LEDNEG 0,-2.7; LEDPOS 0,2.7 | hole 1: 2.54,0

### Placement (x,y rotation side)
C1  11.75,70 0 top
C2  56,69.25 90 top
C3  45.5,69 90 top
C4  20.52,69.1 180 top
C5  36.5,71 90 top
C6  41,52.25 0 top
C7  26.25,34.5 90 top
C8  20.5,55.5 90 top
C9  1.75,64.75 90 top
C10  31.5,102.64 0 top
C11  28.27,90.91 270 top
C12  31.5,104.25 180 top
C13  26.33,88.67 270 top
C14  12.5,42.75 0 top
C15  5.5,56.5 180 top
C16  11.5,56.5 0 top
C17  8.75,69.25 90 top
C18  44.5,66 0 top
C19  56,65.5 90 top
C20  41.38,42 0 top
C21  30.62,63.62 180 top
D1  41.5,75.5 0 top
D2  41.5,72.38 0 top
D3  17.28,17.78 270 top
D4  34.76,18.02 270 top
D5  36.85,22.05 270 top
D6  39.57,25.68 0 top
D7  42.86,28.81 0 top
D8  46.61,31.36 0 top
D9  50.74,33.25 0 top
D10  32.77,4.68 270 top
D11  32.69,9.21 270 top
D12  37.6,82.55 90 top
D24  27.19,4.68 270 top
D25  27.27,9.21 270 top
D26  26.6,13.7 270 top
D27  25.2,18.02 270 top
D28  23.11,22.05 270 top
D29  20.39,25.68 180 top
D30  17.1,28.81 180 top
D31  13.35,31.36 180 top
D32  9.22,33.25 180 top
D33  33.36,13.7 270 top
D34  22.36,82.55 90 top
D35  29.98,86.66 180 top
D40  42.68,17.78 270 top
IC1  30,97.13 0 top
IC3  50.75,66 270 top
IC4  8.5,63.25 180 top
J1  7.12,48.9 0 top
J2  7.12,77.47 0 top
J3  52.84,96.52 0 top
J4  7.12,96.52 0 top
J5  52.84,48.9 0 top
J6  17.28,7.62 0 top
J7  42.68,7.62 0 top
J8  52.84,77.47 0 top
J12  7.12,7.62 0 top
J13  52.84,7.62 0 top
J14  43.34,77.73 90 bottom
OUTLINE  -0.5,0 0 top
Q1  45.11,56.95 180 top
Q2  49.5,86 90 top
Q3  39.01,16.84 180 top
Q5  13.83,15.4 270 top
R1  48.93,103.71 0 top
R2  11.75,68.5 180 top
R3  11.75,71.5 0 top
R4  44,62.75 90 top
R5  57.5,69.25 270 top
R6  45.5,62.75 270 top
R7  37,59 180 top
R8  44,69 270 top
R9  37,61.5 180 top
R10  45.25,18.12 90 top
R11  2.25,89.75 90 top
R12  5.5,58 0 top
R13  3.25,64.75 270 top
R14  12.94,52.98 270 top
R15  3.25,61.75 270 top
R16  2,69.75 90 top
R17  29.98,46.99 0 top
R18  49.07,57.73 180 top
R19  37.77,14.05 180 top
R20  45.06,50.44 270 top
R21  42.26,21.55 180 top
R22  11.5,58 180 top
R23  3.5,69.75 90 top
R24  11.87,1.53 0 top
R25  57.17,14.07 0 top
R26  40.12,56.38 270 top
R27  45.87,102.92 270 top
R28  8.5,56.5 180 top
R29  14,60.5 270 top
R30  14.66,53 270 top
R31  21.75,77.5 270 top
R32  38.5,36 90 top
R33  12.5,36 90 top
R34  34.24,86.69 0 top
R35  18.62,22 180 top
R36  49.77,71.58 0 top
R37  52.91,71.61 180 top
R38  30.68,30.7 0 top
R39  17.82,14.47 0 top
R40  15.38,22 180 top
R41  1.75,61.75 270 top
R42  19.82,96.52 0 top
R43  4.5,89 0 top
R44  7.12,22.86 0 top
R45  52.84,22.86 0 top
R46  43,36 90 top
R47  44.5,36 90 top
R48  41.5,36 90 top
R49  40,36 90 top
R50  23.14,71.98 90 top
R51  18,72.08 90 top
R52  56,62.5 270 top
R53  57.5,64 270 top
R54  47.5,36 90 top
R55  46,36 90 top
R56  21.5,36 90 top
R57  20,36 90 top
R58  23,36 90 top
R59  24.5,36 90 top
R60  35.5,36 90 top
R61  17,36 90 top
R62  18.5,36 90 top
R63  15.5,36 90 top
R64  14,36 90 top
R65  37,36 90 top
R66  37.76,78.37 270 top
R68  29.98,77.47 0 top
R69  40.14,96.52 0 top
R72  53,85 180 top
R73  42.84,86.15 90 top
RX  23.36,64.95 0 bottom
SWD1  16.14,55.36 0 bottom
U1  20.75,61 90 top
U2  41,49.5 90 top
U3  46.5,41.62 90 top
U4  30.75,34.75 90 top
U5  16.5,42.5 90 top
U6  20.61,72.08 270 top
U7  30.5,59.5 0 top
U$1  29.98,25.4 0 top

### Tracks (layer width: path | path; a pad name or v marks a point on that pad's centre or on a via)
3.3V  (via drill 0.3)
  Top 0.254: U6.4 19.67,69.19 C4.2 | R51.1 18.75,71.32 | 18.75,71.32 19.13,71.32 U6.4 | U6.4 19.74,70.78 20.2,71.25 20.2,71.75 20.84,72.39 21.98,72.39 R50.1 23.25,71.12 v23.25,69.75 | IC1.2 30,96.5 | 30,96.5 30,96.88 | 30,96.88 IC1.4 32.26,102.54 C10.2 32.77,103.14 C12.+ | 30,96.88 27.62,96.88 26.38,95.62 26.38,93.8 R42.P$3 24.38,87.84 24.38,81.75 32.56,73.56 R68.P$3 32.52,70.77 29.75,68 | v20.75,53.25 21.5,54 21.5,54.88 | 21.5,54.88 21.5,55.5 20.74,56.26 C8.2 U1.3 | U4.16 28.25,35 | 28.25,35 26.51,35 C7.2 26.25,36.25 25.62,36.88 25.62,37.25 24.75,38.12 24.12,38.12 v20.25,42 | U5.16 C14.2 13.26,42.14 v13.5,41.88 | 29.75,62 29.75,63.13 C21.2 29.75,63.28 29.75,68 | 29.75,62 29.16,61.41 U7.1 | v24.25,68.75 25,68 29.75,68 | R69.P$3 42.84,89.69 R73.2 42.88,86.88 38.38,86.88 33.75,91.5 33.75,95.25 32.5,96.5 30,96.5 | U4.10 32.81,35.94 v32.88,35.88 | U5.10 17.75,44.88 | 17.75,44.88 17.75,47.12 v18,47.38 18.12,47.5 18.12,50.25 20.75,52.88 v20.75,53.25 | 20.88,53.12 v20.75,53.25 | v13.5,44.5 13.5,45.88 13.62,46 | 13.62,46 v15,47.38 | v20.25,43.5 19.12,43.5 17.75,44.88 | v28.75,35.88 28.75,35.5 28.25,35 | U3.10 47.88,42.95 47.88,44.5 | 47.88,44.5 47.88,45.25 46.88,46.25 46.25,46.25 | 46.25,46.25 42,46.25 | 42,46.25 38.88,46.25 36.62,48.5 36.62,51.25 v33.62,54.25 | 29.75,54.88 29.75,54.75 29.88,54.62 v29.88,54.12 | 29.75,54.88 29.75,62 | R20.2 46.25,48.48 46.25,46.25 | U3.16 42.52,41.88 arc90 C20.2 42.25,42.24 v42.25,41.62 | v42.12,46.25 42,46.12 42,46.25 | 13.62,46 12.5,46 4.62,38.12 4.62,25.75 7.75,22.62 7.75,18.11 R44.P$3 9.7,16.32 12.25,18.88 v13.62,18.88 | D40.+ 42.68,18.95 43.5,18.12 46.25,18.12 50,14.38 53.63,14.38 R45.P$3 54.25,17.33 54.25,24.62 55.62,26 55.62,38 49.12,44.5 47.88,44.5
  Top 0.254: 29.75,54.88 v27.38,54.88 | v25.62,54.88 21.5,54.88 | v9.5,69 9.26,69 C17.1 8.5,68.49 IC4.4 v8.5,64.38 | v14.25,69.75 15.75,71.25 v16.25,71.25 | v18.75,71.25 18.75,71.32 | R29.1 13.99,61.25 v13.38,61.25
  Bottom 0.254: SWD1.1 18.89,53.25 v20.75,53.25 | v23.25,69.75 v24.25,68.75 | R17.P$3 32.88,39.98 v32.88,35.88 v28.75,35.88 | v13.5,41.88 v13.5,44.5 | v15,47.38 v18,47.38 | v20.25,42 v20.25,43.5 | v42.25,41.62 42.12,41.75 v42.12,46.25 | v27.38,54.88 v25.62,54.88 | v16.25,71.25 16.32,71.32 18.75,71.32 v18.75,71.25 | v13.38,61.25 10.38,61.25 8.5,63.12 v8.5,64.38 | v29.88,54.12 30,54.25 v33.62,54.25 | v14.25,69.75 13.5,69 v9.5,69 | v13.62,18.88 17.11,18.88 D3.+
12V  (via drill 0.3)
  Top 0.254: C18.2 IC3.4 49.75,66 50.25,66.5 50.25,69.88 v50.75,70.38 | C13.+ 28.05,89.94 C11.2 30.85,90.15 | 30.85,90.15 32.14,91.44 32.14,93.82 IC1.3 | 30.85,90.15 33.6,90.15 43.5,80.25 D1.2 48.12,75.5 49.5,74.12 | R39.2 18.23,14.5 19.12,14.5 23.12,10.5 23.12,3.75 25.38,1.5 34.5,1.5 37,4 R19.2 36.62,14.43 36.62,18.25 47.88,29.5 51.62,29.5 53.5,31.38 v53.5,38 | v56,60.25 57.75,58.5 57.75,53.62 54.75,50.62 54.75,47 55.38,46.38 55.38,41 v54.62,40.25 | v57.38,61.62 59,63.25 59,71.25 54.5,75.75 51.12,75.75 49.5,74.12 | v49.5,73.5 49.5,74.12
  Bottom 0.254: v56,60.25 v57.38,61.62 | v53.5,38 54.62,39.12 v54.62,40.25 | v50.75,70.38 50.75,72.25 v49.5,73.5
-12V  (via drill 0.3)
  Top 0.254: C19.2 55.74,66 IC3.11 52,66 51.25,65.25 51.25,60.5 50.5,59.75 41.25,59.75 40.38,58.88 | D2.1 39.4,72.27 | 39.4,72.27 C5.- | R26.1 40.12,58.62 40.38,58.88 | 39.4,72.27 38,70.88 v38,66.5 | v40.12,59.12 40.38,58.88
  Bottom 0.254: v38,66.5 40.12,64.38 v40.12,59.12
ADC_FREQ  (via drill 0.3)
  Top 0.203: C16.2 R22.1 12.31,58 IC4.14 12.31,61.94 12.5,62.12 14.62,62.12 v14.88,62.38 | v20.62,65.12 20.62,65.25 20.5,65.12 U1.16
  Bottom 0.203: v20.62,65.12 20.5,65.25 v18.75,65.25 17.75,65.25 v14.88,62.38
ADC_MOD
  Top 0.203: C1.2 R2.1 12.31,68.5 IC4.1 12.65,65.85 17.25,61.25 U1.21
ADC_NORMAL  (via drill 0.3)
  Top 0.203: U1.9 24,60.75 24.38,60.38 24.38,58.75 26.5,56.62 26.5,53.88 v20.88,48.25 | R44.P$2 7.12,22.25 4,25.38 4,38.5 12.75,47.25 v13.25,47.25
  Bottom 0.203: v13.25,47.25 14.25,48.25 v20.88,48.25
ADC_PHASE  (via drill 0.3)
  Top 0.203: C9.2 R13.1 3.26,65.5 4,65.5 4.35,65.85 IC4.7 4.69,64.69 v4.62,64.62 | U1.10 24.5,61.25 v24.75,61 | v6.5,64 7.88,64 8.62,63.25 11.75,63.25 v12,63.5 | v13,67.38 13.88,68.25 v16.75,68.25 | v26.25,62.5 26.88,63.12 v26.88,64.88 | v26.88,67.12 v22.88,67.12
  Bottom 0.203: v24.75,61 v26.25,62.5 | v4.62,64.62 5.88,64.62 v6.5,64 | v12,63.5 12,66.38 v13,67.38 | v26.88,64.88 v26.88,67.12 | v22.88,67.12 21.75,68.25 v16.75,68.25
ADC_PHASED  (via drill 0.3)
  Top 0.203: v28.62,66.12 23.38,66.12 21.5,64.25 21.5,63.21 U1.14 | R45.P$2 53.75,17.07 53.75,25 55.12,26.38 55.12,37.62 49,43.75 v48.75,43.75 | v45.25,47.25 39.38,47.25 37.62,49 37.62,56.38 v36.25,57.75 | v32.5,66.12 33.5,66.12 35.25,64.38 35.25,63.25 v34.75,62.75
  Bottom 0.203: v32.5,66.12 v28.62,66.12 | v48.75,43.75 48.38,44.12 48.38,45.5 46.62,47.25 v45.25,47.25 | v34.75,62.75 34.75,59.25 v36.25,57.75
ADC_SHAPE  (via drill 0.3)
  Top 0.203: C15.2 R12.1 4.69,58.05 IC4.8 4.69,61.81 v4.62,61.88 | v5.88,62.62 13.25,62.62 13.75,63.12 v13.75,63.75 | U1.15 21,64.5 21.5,65 21.5,66.38 21.12,66.75 v20.75,66.75 | 17.88,66.75 v18.12,66.75 14.75,66.75 v13.75,65.75
  Bottom 0.203: v4.62,61.88 5.12,61.88 v5.88,62.62 | v20.75,66.75 v18.12,66.75 | v13.75,63.75 v13.75,65.75
CLOCK  (via drill 0.3)
  Top 0.203: U3.11 47.26,43.76 47.38,43.88 47.38,45.12 46.75,45.75 45.88,45.75 45.38,45.25 38.5,45.25 35.88,42.62 | 35.88,42.62 34.75,41.5 34.75,40 32.75,38 31.88,38 31.5,37.62 31.5,35.96 U4.11 | U5.11 17.26,49.89 v17.38,50 | U1.1 19.5,57.76 16.12,54.38 16.12,51.25 v14.88,50 | v19,50 19,50.25 20.38,51.62 v23.25,51.62 | v24.25,50.75 27.75,50.75 v29.62,48.88 | v31.5,47 35.88,42.62
  Bottom 0.203: v14.88,50 v17.38,50 v19,50 | v23.25,51.62 23.38,51.62 v24.25,50.75 | v29.62,48.88 v31.5,47
CPU_RESET  (via drill 0.3)
  Top 0.203: v13.5,58.75 14,59.25 R29.2 14.51,60.25 15.5,60.25 15.88,59.88 15.88,59.25 16.25,58.88 17.12,58.88 17.5,59.25 17.5,60.12 17.62,60.25 17.98,60.25 17.99,60.24 U1.23
  Bottom 0.203: SWD1.10 13.5,56.97 v13.5,58.75
DACCS  (via drill 0.3)
  Top 0.203: U1.7 22.95,58.92 v24.12,57.75 | v26.75,59.75 27.14,60.13 U7.2
  Bottom 0.203: v24.12,57.75 24.75,57.75 v26.75,59.75
DACSCK
  Top 0.203: U1.12 25.25,62.25 26,61.5 26,59.5 26.64,58.87 U7.3
DACSDI
  Top 0.203: U1.11 22.96,61.75 25,61.75 25.5,61.25 25.5,58.75 26.66,57.59 U7.4
GND  (via drill 0.3)
  Top 0.203: C12.- v29,104.25 | C10.1 v30,102.64 | IC1.1 27.7,95.33 v27.75,95.38 | IC3.5 49.48,64.73 v49.5,64.75 | IC3.3 49.48,67.27 v49.5,67.25 | IC3.12 52.02,67.27 v52,67.25 | IC3.10 52.02,64.73 v52,64.75 | C19.1 55.26,64.74 v55.25,64.75 | C18.1 v43.5,66 | Q1.E 43.3,58.05 v43.25,58 | U7.7 33.88,60.13 v34.12,60.12 | U7.5 v34.12,57.62 | C21.1 31.21,63.71 v31.25,64.5 | U6.2 20.61,74.39 v20.58,74.42 | C4.1 21.29,70.52 U6.5 21.97,70.78 v22,70.75 | IC4.5 7.23,67.15 v7.25,67.14 | IC4.3 9.77,64.15 v9.79,64.14 | IC4.10 7.23,59.2 v7.25,59.18 | IC4.11 8.5,59.2 v8.52,59.18 | IC4.12 9.77,59.2 v9.79,59.18 | C13.- 26.33,86.39 v26.3,86.36 | C11.1 28.27,92.39 v28.2,92.46 | C17.2 8.79,69.64 v8.01,69.6 | C8.1 20.24,55 v20.25,55.25 | U1.4 21,60.75 U1.25 v20.25,60.5 | U5.8 16.75,42.25 U5.17 16.25,42.75 U5.13 | C14.1 11.74,42.01 v12,41.75 | U3.8 46.63,41.37 U3.17 46.25,41.75 U3.13 46.25,44.12 v46.25,44.5 | Q2.E 51.7,86.95 v51.75,87 | Q3.E 37.81,17.56 v37.75,16.88 | U4.8 31,34.5 arc-90 U4.17 arc-90 30.5,35 U4.13 | C7.1 v26.25,33 | C5.+ 36.48,69.75 v35.5,69.75 | U2.1 40.12,47.92 v40.12,49.38 | C6.1 v39.5,52.25 | C20.1 40.75,42.26 v40.75,41.25 | Q5.E 12.38,14.46 v12.38,13.5
  Bottom 0.203: v29,104.25 29,104.5 | v30,102.64 29.75,102.64 | v27.75,95.38 27.5,95.63 | v49.5,64.75 49.75,64.75 | v49.5,67.25 49.75,67.25 | v52,67.25 51.75,67.25 | v52,64.75 51.75,64.75 | v55.25,64.75 55,64.75 | v43.5,66 43.25,66 | v43.25,58 43.25,58.25 | v31.25,64.5 31,64.25 | v20.58,74.42 21.09,74.42 | v7.25,67.14 7.25,67.01 | v9.79,64.14 9.66,64.01 | v7.25,59.18 7.25,58.93 | v8.52,59.18 8.52,59.05 | v9.79,59.18 9.79,59.05 9.66,58.93 | v26.3,86.36 26.3,86.11 | v28.2,92.46 28.07,92.46 | v8.01,69.6 7.76,69.6 | v20.25,55.25 20.12,55.12 | v22,70.75 22,70.5 | v12,41.75 12.5,41.5 | v51.75,87 52,87 | v46.25,44.5 46.25,44.38 | v26.25,33 26,33 arc90 25.88,32.88 | v35.5,69.75 35.25,69.75 | v40.12,49.38 40,48.88 39.38,49 | 39.25,52.25 v39.5,52.25 | v40.75,41.25 40.38,40.88 | v12.38,13.5 12.25,13.5 12.25,13
  other vias: 21.25,61.5 30.75,34.75 46.5,41.62 16.5,42.5
  pour Bottom: -1.14,106.68 -5.58,-2.54 63,-1.91 63,109.86
KNOB_FREQ  (via drill 0.3)
  Top 0.203: R30.2 14.24,52.24 v12.88,50.88 | v28.88,44.25 29.12,44.25 30,43.38 30,40.31 R17.P$2 | v21.25,50.25 21.25,50 20,48.75 20,46 21.75,44.25 v24.88,44.25
  Bottom 0.203: v12.88,50.88 20.62,50.88 v21.25,50.25 | v24.88,44.25 v28.88,44.25
KNOB_MOD
  Top 0.203: R69.P$2 40.14,97.58 44.72,102.16 R27.2
KNOB_PHASE
  Top 0.203: R42.P$2 18.12,88.12 6.14,88.12 R43.2
KNOB_SHAPE  (via drill 0.3)
  Top 0.203: R68.P$2 29.98,72.02 27.25,74.75 21.62,74.75 21.12,75.25 14.38,75.25 v12,72.88 | v6.38,71.75 4.74,71.75 R23.2
  Bottom 0.203: v12,72.88 10.88,71.75 v6.38,71.75
LATCH  (via drill 0.3)
  Top 0.203: U3.12 46.75,44 46.88,44.12 46.88,44.88 46.5,45.25 46,45.25 45.5,44.75 39,44.75 v35.5,41.25 35.5,39.88 32.75,37.12 v32.12,37.12 | U4.12 31,37.75 v30.88,37.88 | U5.12 16.75,45.85 | 16.75,45.85 16.75,48.87 v16.38,49.25 | v13.75,49.25 13.75,50 14.38,50.62 14.88,50.62 15.62,51.38 15.62,54.12 15,54.75 v15,59.62 | 16.75,45.85 16.73,45.88 v16.38,45.88 | v18.5,45.88 19.25,46.62 19.25,49.25 21,51 22,51 v22.38,50.62 | v23.38,49.62 26.62,49.62 v28.38,47.88 | v17.25,62.88 17.25,62.62 17.62,62.25 18.5,62.25 U1.19 | v30.38,45.88 v34.25,42
  Bottom 0.203: v32.12,37.12 31.62,37.12 v30.88,37.88 | v16.38,49.25 v13.75,49.25 | v16.38,45.88 v18.5,45.88 | v22.38,50.62 v23.38,49.62 | v28.38,47.88 v30.38,45.88 | v17.25,62.88 15,60.62 v15,59.62 | v34.25,42 35,41.25 v35.5,41.25
N$1
  Top 0.203: R33.2 12.5,39.75 10.75,41.5 10.75,43.25 11.25,43.75 15.2,43.75 U5.15
N$2
  Top 0.203: IC3.6 45.55,63.46 R6.1 R4.2
N$3
  Top 0.203: R16.2 2,72.35 7.12,77.47 J2.TIP@3
N$4
  Top 0.203: C15.1 R12.2 5.96,58.3 IC4.9 5.96,61.54 5,62.5 3.26,62.5 R15.1 2.46,61.72 0.9,61.72 0.64,61.98 0.64,66.8 2,68.16 R16.1 R23.1
N$5
  Top 0.203: U7.8 36.14,61.41 R9.2
N$6
  Top 0.203: J3.TIP@3 50.13,103.77 R1.2
N$7
  Top 0.203: U7.6 36.1,58.87 R7.2
N$8
  Top 0.203: IC4.2 10.99,65.85 R2.2 C1.1 R3.1 10.99,72.83 12.58,74.43 12.58,81.03 9.41,84.2 3.06,84.2 0.77,86.49 0.77,99.19 7.12,105.54 44.46,105.54 45.99,104 R27.1 45.9,103.71 R1.1
N$9
  Top 0.203: R5.2 C2.1 55.95,68.54 IC3.13 53.31,68.5 51.75,68.5 | R37.1 53.67,70.79 53.5,70.62 52,70.62 51.75,70.38 51.75,68.5 | 51.75,68.5 50.75,67.5 50.75,60.75 50.38,60.38 40.12,60.38 39,61.5 R9.1
N$10
  Top 0.203: R36.1 49.01,70.99 49.75,70.25 49.75,68.75 49.5,68.5 48.19,68.5 IC3.2 45.8,68.54 C3.1 R8.2 42.49,68.24 37,62.75 37,59.76 R7.1
N$11
  Top 0.203: J4.TIP@3 7.12,96.62 2.25,91.75 R11.2
N$12  (via drill 0.3)
  Top 0.203: R41.1 C9.1 R13.2 3.26,64 5,64 5.96,64.96 IC4.6 5.96,69.83 7.76,71.63 8.65,71.63 9.79,72.77 9.79,74.93 8.26,76.45 8.26,78.99 v10.55,81.28 | R11.1 3.73,88.99 R43.1 7.27,85.47 9.28,85.47 v11.95,82.8
  Bottom 0.203: v10.55,81.28 10.55,81.41 v11.95,82.8
N$13  (via drill 0.3)
  Top 0.254: v39,78.25 39,76 D1.1
  Bottom 0.254: J14.10 J14.9 39.75,79 v39,78.25
N$14
  Top 0.203: R47.1 44.5,33.5 41.5,30.5 41.5,28.9 D7.+
N$15
  Top 0.203: Q1.B 46.38,57.73 R18.2
N$16
  Top 0.203: J5.TIP@3 52.84,57.03 52.14,57.73 R18.1
N$17
  Top 0.203: IC3.9 55.8,63.46 R52.1 57.48,63.26 R53.2
N$18  (via drill 0.3)
  Top 0.203: IC3.1 48.1,69.76 C3.2 R8.1 42.76,69.76 v39.75,66.75 | 41,65.49 v41,65.5 41,64.99 R4.1
  Bottom 0.203: v41,65.5 v39.75,66.75
N$19
  Top 0.203: U5.1 14.8,37.56 R64.2
N$20
  Top 0.203: J13.TIP@3 54.76,12.12 R25.1
N$21
  Top 0.203: J12.TIP@3 7.12,7.75 11.11,3.77 R24.1
N$22
  Top 0.203: R63.2 15.5,38.75 15.25,39 U5.2
N$23
  Top 0.203: D40.- 43.53,17.36 R10.1
N$24
  Top 0.203: R53.1 57.5,66.5 58.5,67.5 58.5,69.01 R5.1 C2.2 55.8,69.81 IC3.14
N$25
  Top 0.203: Q3.B 39.75,17.36 39.75,19.5 41.5,21.25 R21.2
N$26
  Top 0.203: U5.3 15.74,39.76 17,38.5 R61.2
N$27
  Top 0.203: D3.- 17.28,16.53 19.38,18.62 19.38,21.99 R35.1
N$28
  Top 0.203: D28.+ 23,23.43 23,26.5 18.5,31 R62.1
N$29
  Top 0.203: Q3.C 38.53,15.26 R19.1 40.75,14.05 J7.TIP@3
N$30
  Top 0.203: U5.4 16.25,40 18.5,37.75 R62.2
N$31
  Top 0.203: U5.5 16.75,40.25 19.25,37.75 19.75,37.75 20,37.5 R57.2
N$32
  Top 0.203: D29.+ 21.66,27.09 17,31.75 R61.1
N$33
  Top 0.203: J1.TIP@3 10.11,53.4 11.25,52.25 12.9,52.25 R14.2
N$34
  Top 0.203: R28.1 C16.1 | C16.1 R22.2 11.04,58 IC4.13 | C16.1 10.74,54.76 11.75,53.75 13.68,53.75 R14.1 14.79,53.74 R30.1
N$35
  Top 0.203: U5.6 17.26,40.49 19.5,38.25 20.01,38.25 R56.2
N$36
  Top 0.203: U5.7 17.75,40.76 19.75,38.75 21.01,38.75 R58.2
N$37
  Top 0.203: U4.3 29.99,32.61 29.62,32.25 25.88,32.25 25.38,32.75 25.38,35.89 R59.2
N$38
  Top 0.203: U3.7 47.74,37.01 R54.2
N$39
  Top 0.203: U3.6 47.26,38.02 R55.2
N$40
  Top 0.203: U3.5 46.75,38.88 45.88,38 45.12,38 44.5,37.38 R47.2
N$41
  Top 0.203: R38.1 29.92,28.16 U$1.LEDPOS
N$43
  Top 0.203: U3.4 46.25,39.25 45.62,38.62 44.86,38.62 R46.2
N$44
  Top 0.203: R72.2 50.65,85 Q2.B
N$45
  Top 0.203: J8.TIP@3 52.84,84.08 R72.1
N$46
  Top 0.203: R46.1 43,34.25 38.25,29.5 38.25,25.73 D6.+
N$47
  Top 0.203: R48.1 41.5,34.25 36.75,29.5 36.75,23.22 D5.+
N$48
  Top 0.203: R49.1 40,34.75 35.5,30.25 35.5,20.03 D4.+
N$49
  Top 0.203: R55.1 46,32.01 D8.+
N$50
  Top 0.203: R54.1 47.5,35.22 D9.+
N$51
  Top 0.203: R60.1 35.5,34 34,32.5 34,21.5 31.62,19.12 31.62,7.25 32.77,6.11 D10.+
N$52
  Top 0.203: D11.+ 32.12,11.05 32.12,18.88 34.5,21.25 34.5,32 37,34.5 R65.1
N$53
  Top 0.203: U3.3 45.74,39.61 45.25,39.12 43.86,39.12 R48.2
N$54
  Top 0.203: U3.2 43.67,40.43 R49.2
N$55
  Top 0.203: U3.1 43.11,41.37 R32.2
N$56
  Top 0.203: U3.15 39.07,42.82 37,40.75 R65.2
N$57
  Top 0.203: U4.7 33.18,33.56 34.5,34.88 34.5,35.76 R60.2
N$58  (via drill 0.3)
  Top 0.203: R34.2 35,84.25 32,81.25 32,76.5 34,74.5 34,70.12 31,67.12 31,65.75 32.38,64.38 32.38,62.88 32.12,62.62 31.38,62.62 30.75,62 30.75,55.5 33,53.25 33,50.5 25.25,42.75 25.25,39.25 27.5,37 v28.12,37 | U4.1 28.5,34.5 v28.38,34.38
  Bottom 0.203: v28.38,34.38 28.12,34.38 v28.12,37
N$59  (via drill 0.3)
  Top 0.203: v23.5,75.5 22.24,76.75 R31.2 | v29,68.75 25.62,68.75 25,69.38 25,73.25 v24.5,73.75 | v31.5,68.75 30.25,67.5 30.25,65.25 30.62,64.88 30.62,62.62 30.25,62.25 30.25,55.25 32.5,53 32.5,50.75 24.62,42.88 24.62,39 26.38,37.25 v26.38,37.12 | U4.2 27.68,33.56 v27.38,33.25
  Bottom 0.203: v23.5,75.5 23.5,74.75 v24.5,73.75 | v29,68.75 v31.5,68.75 | v27.38,33.25 27.25,33.25 26.62,33.88 26.62,36.88 v26.38,37.12
N$60
  Top 0.203: R40.2 14.61,18.24 Q5.B
N$61
  Top 0.203: J6.TIP@3 17.28,14.25 R39.1 16.12,15.4 Q5.C
N$62
  Top 0.203: R66.2 34.62,74.48 34.62,69.88 31.62,66.88 31.62,66 32.88,64.75 32.88,62.62 32.38,62.12 31.62,62.12 31.25,61.75 31.25,55.75 33.5,53.5 33.5,50.25 25.88,42.62 25.88,39.5 27.5,37.88 28.38,37.88 29.5,36.75 29.5,36 U4.15
N$64  (via drill 0.3)
  Top 0.254: D2.2 40.12,69 v38.75,69
  Bottom 0.254: J14.2 J14.1 38.91,68.84 v38.75,69
N$65
  Top 0.203: D12.+ 37.76,81.12 R66.1
N$73
  Top 0.203: D27.+ 24.5,19.99 24.5,25.75 20,30.25 R57.1
N$74
  Top 0.203: D26.+ 26.75,15.37 26.75,19.5 25,21.25 25,26 21.5,29.5 R56.1
N$75
  Top 0.203: D25.+ 27.75,10.96 27.75,19.25 25.5,21.5 25.5,26.25 23,28.75 R58.1
N$76
  Top 0.203: D24.+ 28.75,7.5 28.75,19 26,21.75 26,26.5 24.5,28 R59.1
N$77
  Top 0.203: D30.+ 18.37,29.63 15.5,32.5 R63.1
N$78
  Top 0.203: D31.+ 14,31.97 R64.1
N$79
  Top 0.203: D32.+ 12.48,35.24 R33.1
N$80
  Top 0.203: D33.+ 33.25,15.08 33.25,19.25 35,21 35,31.5 38.5,35 R32.1
N$81
  Top 0.203: D34.+ 22.36,78.87 R31.1
N$82
  Top 0.203: D35.+ 31.28,86.69 R34.1
NORMALOUT  (via drill 0.3)
  Top 0.203: R6.2 45.7,62.19 IC3.7 48.15,61.35 v48.38,61.12 | R24.2 13.29,0.88 53,0.88 58.88,6.75 58.88,17.75 55.25,21.38 55.25,24 59,27.75 59,60.75 v58.88,60.88 | v55.38,58.88 v51.38,58.88
  Bottom 0.203: v58.88,60.88 57,58.88 v55.38,58.88 | v51.38,58.88 48.62,61.12 v48.38,61.12
OUT_LFOCYCLEMID  (via drill 0.3)
  Top 0.203: U4.5 31,31.88 30.69,31.56 30.69,29.5 31.25,28.94 31.25,27 30.88,26.62 30.88,24 31.25,23.62 31.25,20.25 30.62,19.62 30.62,3.25 31.75,2.12 33.88,2.12 v35,3.25 | v36.38,2 37.12,2 45.25,10.12 45.25,13.38 44,14.62 41.88,14.62 41.12,15.38 41.12,19.5 43.02,21.4 R21.1 45.25,19.33 R10.2
  Bottom 0.203: v35,3.25 36.25,2 v36.38,2
OUT_LFOCYCLESTART  (via drill 0.3)
  Top 0.203: R40.1 R35.2 17.86,25.99 v19.5,27.62 | v25.5,30.25 27,31.75 30,31.75 30.5,32.25 U4.4
  Bottom 0.203: v19.5,27.62 22.88,27.62 v25.5,30.25
PHASEDOUT
  Top 0.203: IC3.8 55.55,62.19 R52.2 58.38,59.36 58.5,28 54.75,24.25 54.75,21.12 57.93,17.95 R25.2
REF_-5V  (via drill 0.3)
  Top 0.203: R15.2 R41.2 1.79,60.95 1.79,59.88 | R37.2 50.56,71.61 R36.2 49.61,72.5 48.25,72.5 47.44,71.69 | R28.2 7.74,55.74 7.25,55.24 3.44,55.24 1.79,56.9 1.79,59.88 | U2.2 41.94,51.82 C6.2 40.12,53.89 R26.2 38.89,55.61 v38.75,55.75 | R3.2 12.01,71 v12,71 | v5.25,70.38 4.75,69.88 4.75,68.38 3.25,66.88 v2.5,66.88 | v2.38,59.88 1.79,59.88 | 47.44,71.69 46.25,70.5 42.75,70.5 40,67.75 39.5,67.75 38.88,67.12 38.88,65.62 36.88,63.62 v36.75,63.62 | v13.25,76.12 13.25,77 23.62,87.38 v23.62,87.5 | v11.88,74.75 10.5,73.38 10.5,72.62 9.75,71.88 v9.75,70.38 | v24.62,88.5 25.12,88.5 25.38,88.75 29.88,88.75 30.75,89.62 33.5,89.62 43,80.12 43,78.25 41.62,76.88 41.62,74.12 41.88,73.88 45.25,73.88 47.44,71.69
  Bottom 0.203: v12,71 11.38,70.38 v9.75,70.38 v5.25,70.38 | v2.5,66.88 2.38,66.75 v2.38,59.88 | v38.75,55.75 38.75,57 37.38,58.38 37.38,63 v36.75,63.62 | v11.88,74.75 v13.25,76.12 | v24.62,88.5 v23.62,87.5
RESET_PATTERN  (via drill 0.3)
  Top 0.203: U1.20 18.54,61.75 17.38,61.75 16.62,62.5 16.62,64 19,66.38 19,67.38 17.5,68.88 16.5,68.88 16.38,68.75 14.38,68.75 13.62,69.5 13.62,70 14.25,70.62 14.25,74.25 14.62,74.62 v15.25,74.62 | U$1.1 32.52,27.39 31.38,26.25 31.38,24.38 32.52,23.23 | 32.52,23.23 U$1.2 | 32.52,23.23 32.5,23.21 32.5,20.75 31.12,19.38 31.12,5.88 32.25,4.75 33.62,4.75 36.12,7.25 36.12,18.5 47.62,30 49.25,30 50.5,31.25 v50.5,40.75 | v52.25,42.38 46.88,47.88 46.88,49.62 45.3,51.2 R20.1 45.11,51.25 Q1.C 44.58,56.38 39,56.38 38.75,56.62 v38.75,60.88 | v30.25,75 30,75.25 24.88,75.25 22.62,77.5 20.38,77.5 18.62,75.75 16.88,75.75 v16.62,76 | v31.12,75.88 31.12,75.62 33.12,73.62 33.12,73.12 v33.38,72.88 | v35.25,71 37,71 37.5,70.5 37.5,67.12 36.75,66.38 v36.75,65.5
  Bottom 0.203: v50.5,40.75 v52.25,42.38 | v31.12,75.88 v30.25,75 | v35.25,71 v33.38,72.88 | v36.75,65.5 38.75,63.5 v38.75,60.88 | v16.62,76 v15.25,74.62
SCL
  Top 0.203: U6.1 22.18,72.75 R50.2 24.5,71.39 24.5,70 22.5,68 20.5,68 19.99,67.49 U1.17
SDA
  Top 0.203: U6.3 19.41,73.37 18.93,72.9 18.06,72.9 R51.2 17,71.84 17,70 19.5,67.5 U1.18
SHIFTER1TO2  (via drill 0.3)
  Top 0.203: U5.9 21,42.75 23.5,40.25 v23.5,40.12 | U4.14 30,35.96 30,37 28.38,38.62 v27.88,38.62
  Bottom 0.203: v27.88,38.62 25,38.62 v23.5,40.12
SHIFTERS
  Top 0.203: U1.2 19.99,57.49 16.75,54.25 16.75,51 15.75,50 15.75,43.71 U5.14
SHIFTERS2TO3
  Top 0.203: U3.14 45.74,44.01 45.5,44.25 39.38,44.25 36.12,41 36.12,39.62 33.88,37.38 33.88,35.62 33.25,35 U4.9
SWD_CLK  (via drill 0.3)
  Top 0.203: U1.22 17,60.75 16.62,60.38 v16.62,59.75
  Bottom 0.203: SWD1.4 17.5,56.95 17.5,59 17.38,59 v16.62,59.75
SWD_DIO  (via drill 0.3)
  Top 0.203: U1.24 18.75,59.55 v18.75,59
  Bottom 0.203: v18.75,59 18.68,58.94 SWD1.2
SYNC_LFO  (via drill 0.3)
  Top 0.203: Q2.C 47.79,85.39 R73.1 38.99,85.39 33.38,91 v33.25,91 | U1.13 22.05,63.25 v22.75,63.25 23.62,63.25 25.88,65.5 28.12,65.5 28.5,65.12 29,65.12 29.25,65.38 29.25,67.12 29,67.38 v28.5,67.38 | v25.88,70 25.88,72.38 v27.25,73.75 | v32.38,88.75 31.38,88.75 30,87.38 30,86.12 27.5,83.62 27.5,79.62 v29.62,77.5
  Bottom 0.203: v22.75,63.25 23.36,63.85 RX.TP | v28.5,67.38 v25.88,70 | v27.25,73.75 27.25,75.12 v29.62,77.5 | v32.38,88.75 32.38,90.12 v33.25,91
TRIGGERBUTTONLED
  Top 0.203: U4.6 31.51,30.76 R38.2